# EAGLE design APS_PowerSwitches_USBhub (EAGLE 5.06)
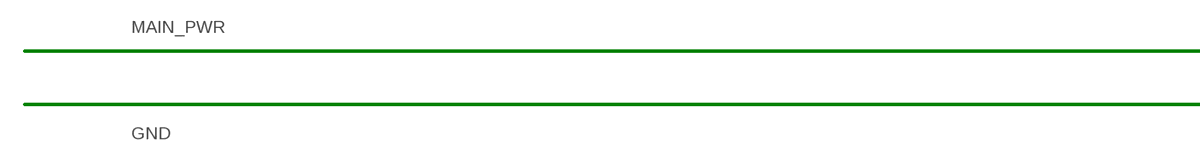
[diagram p0: schematic, sheet 1, part 1 of 3]
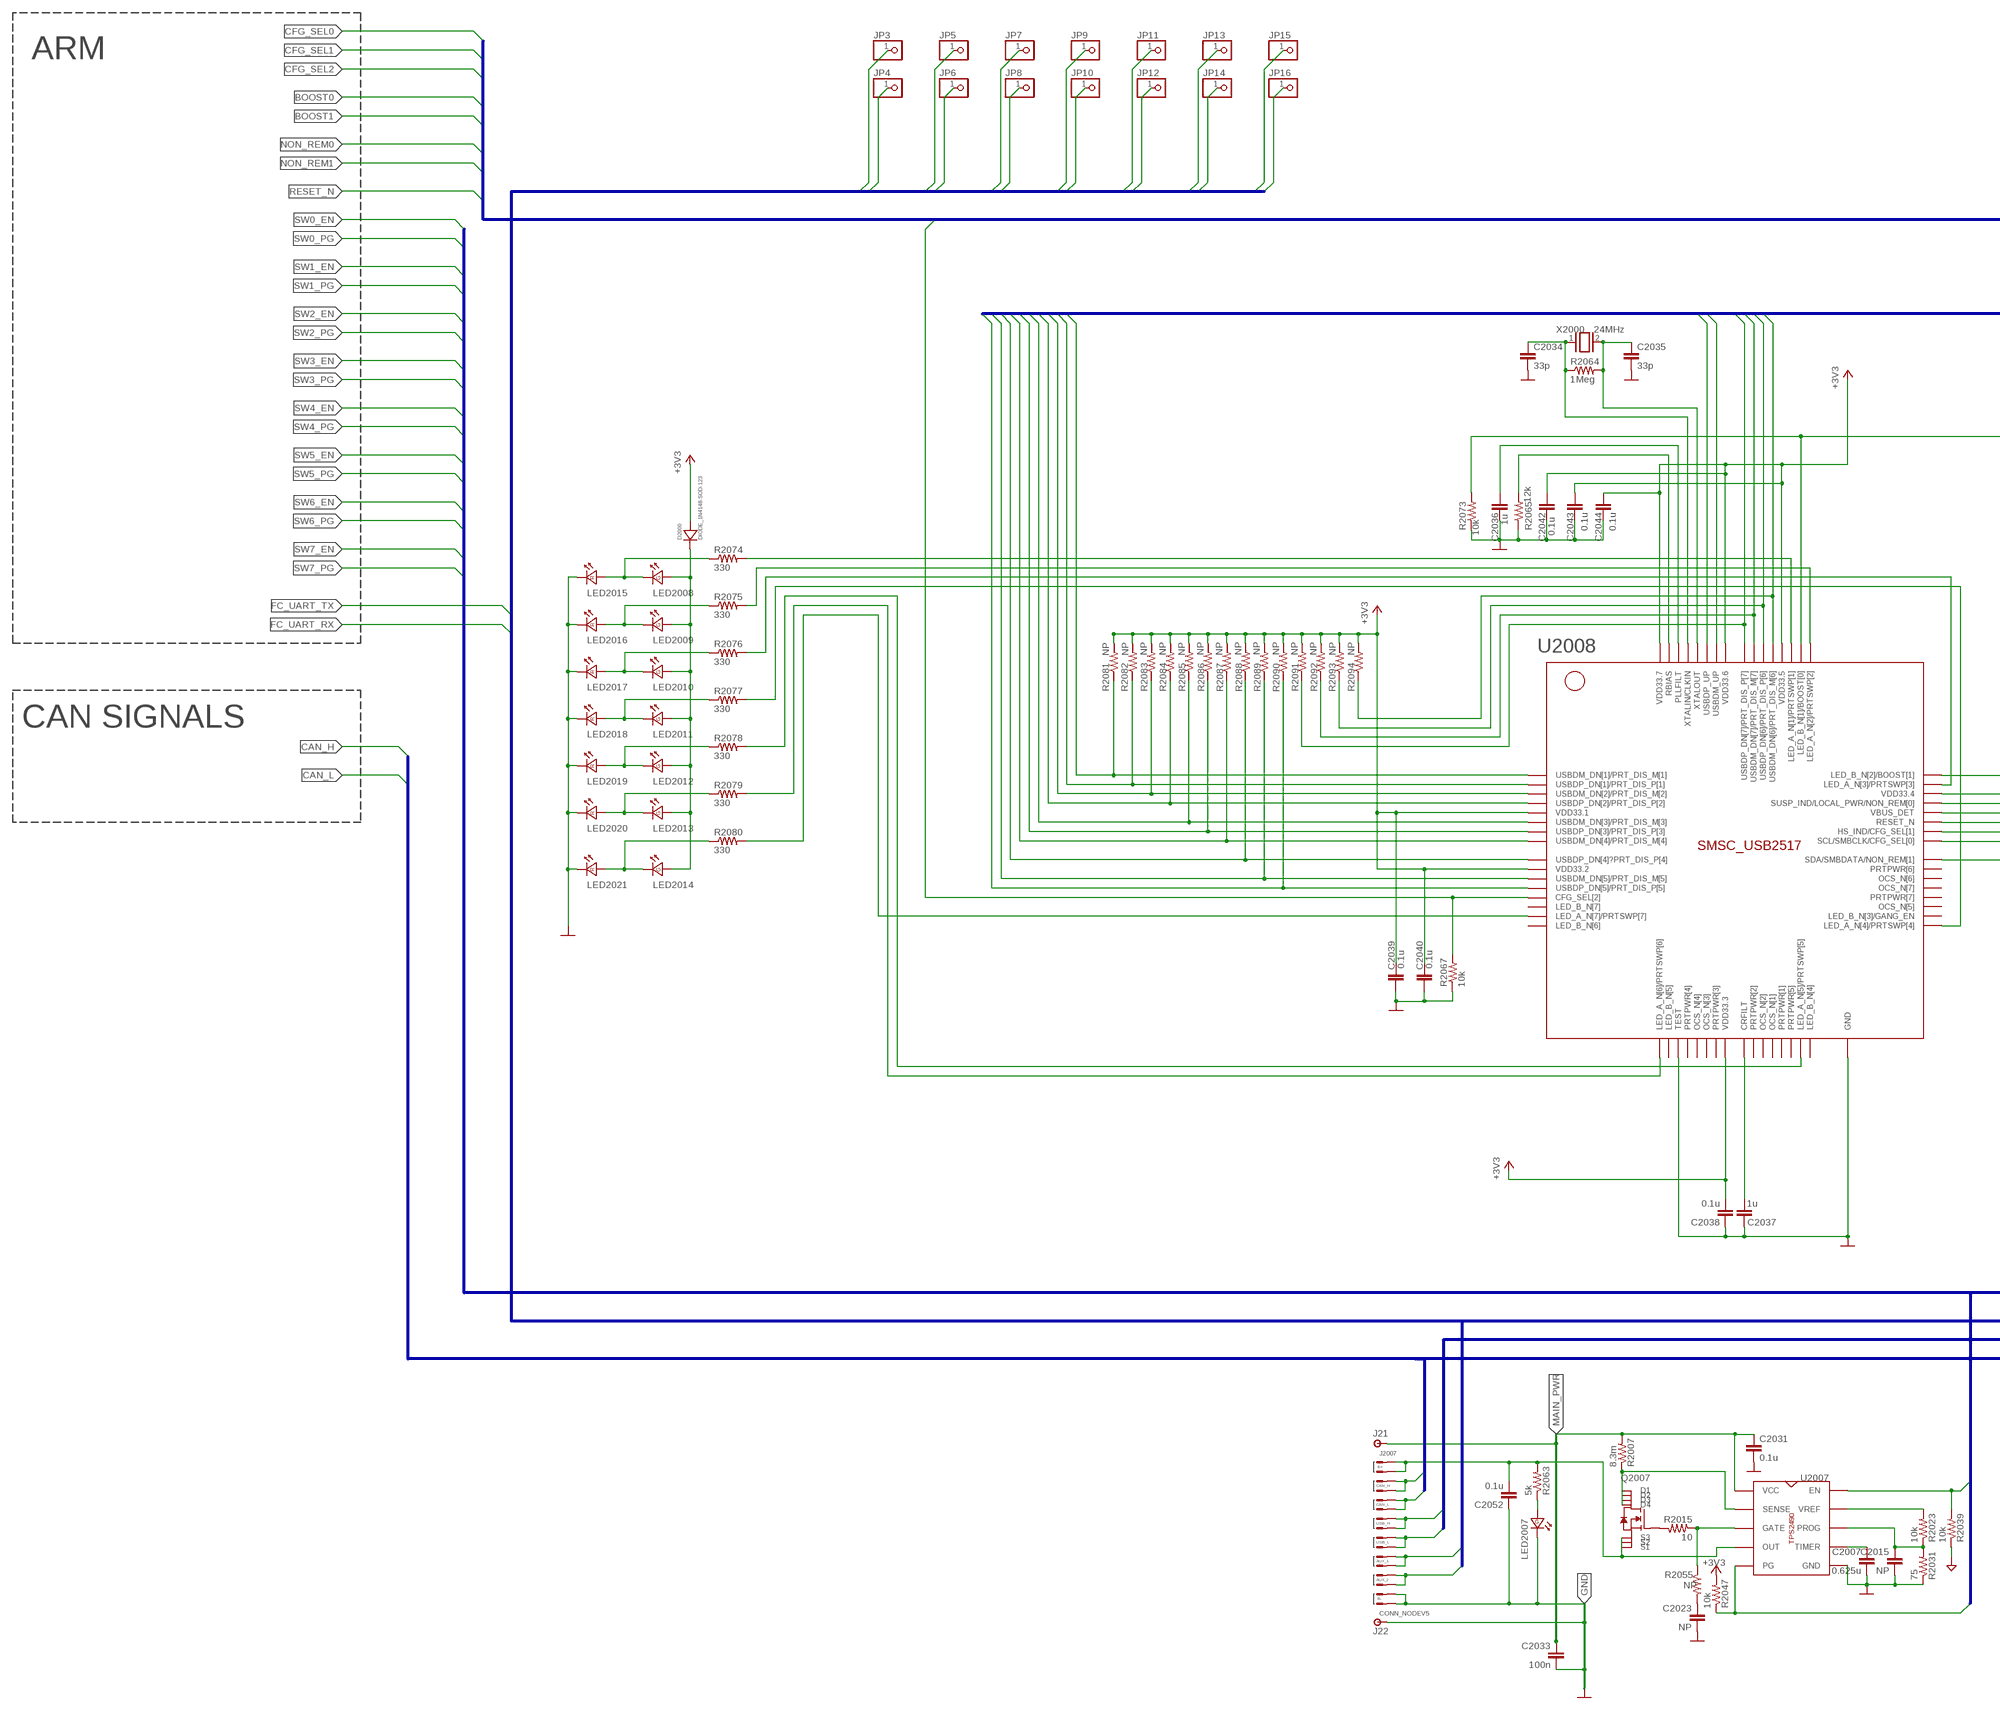
[diagram p1: schematic, sheet 1, part 2 of 3]
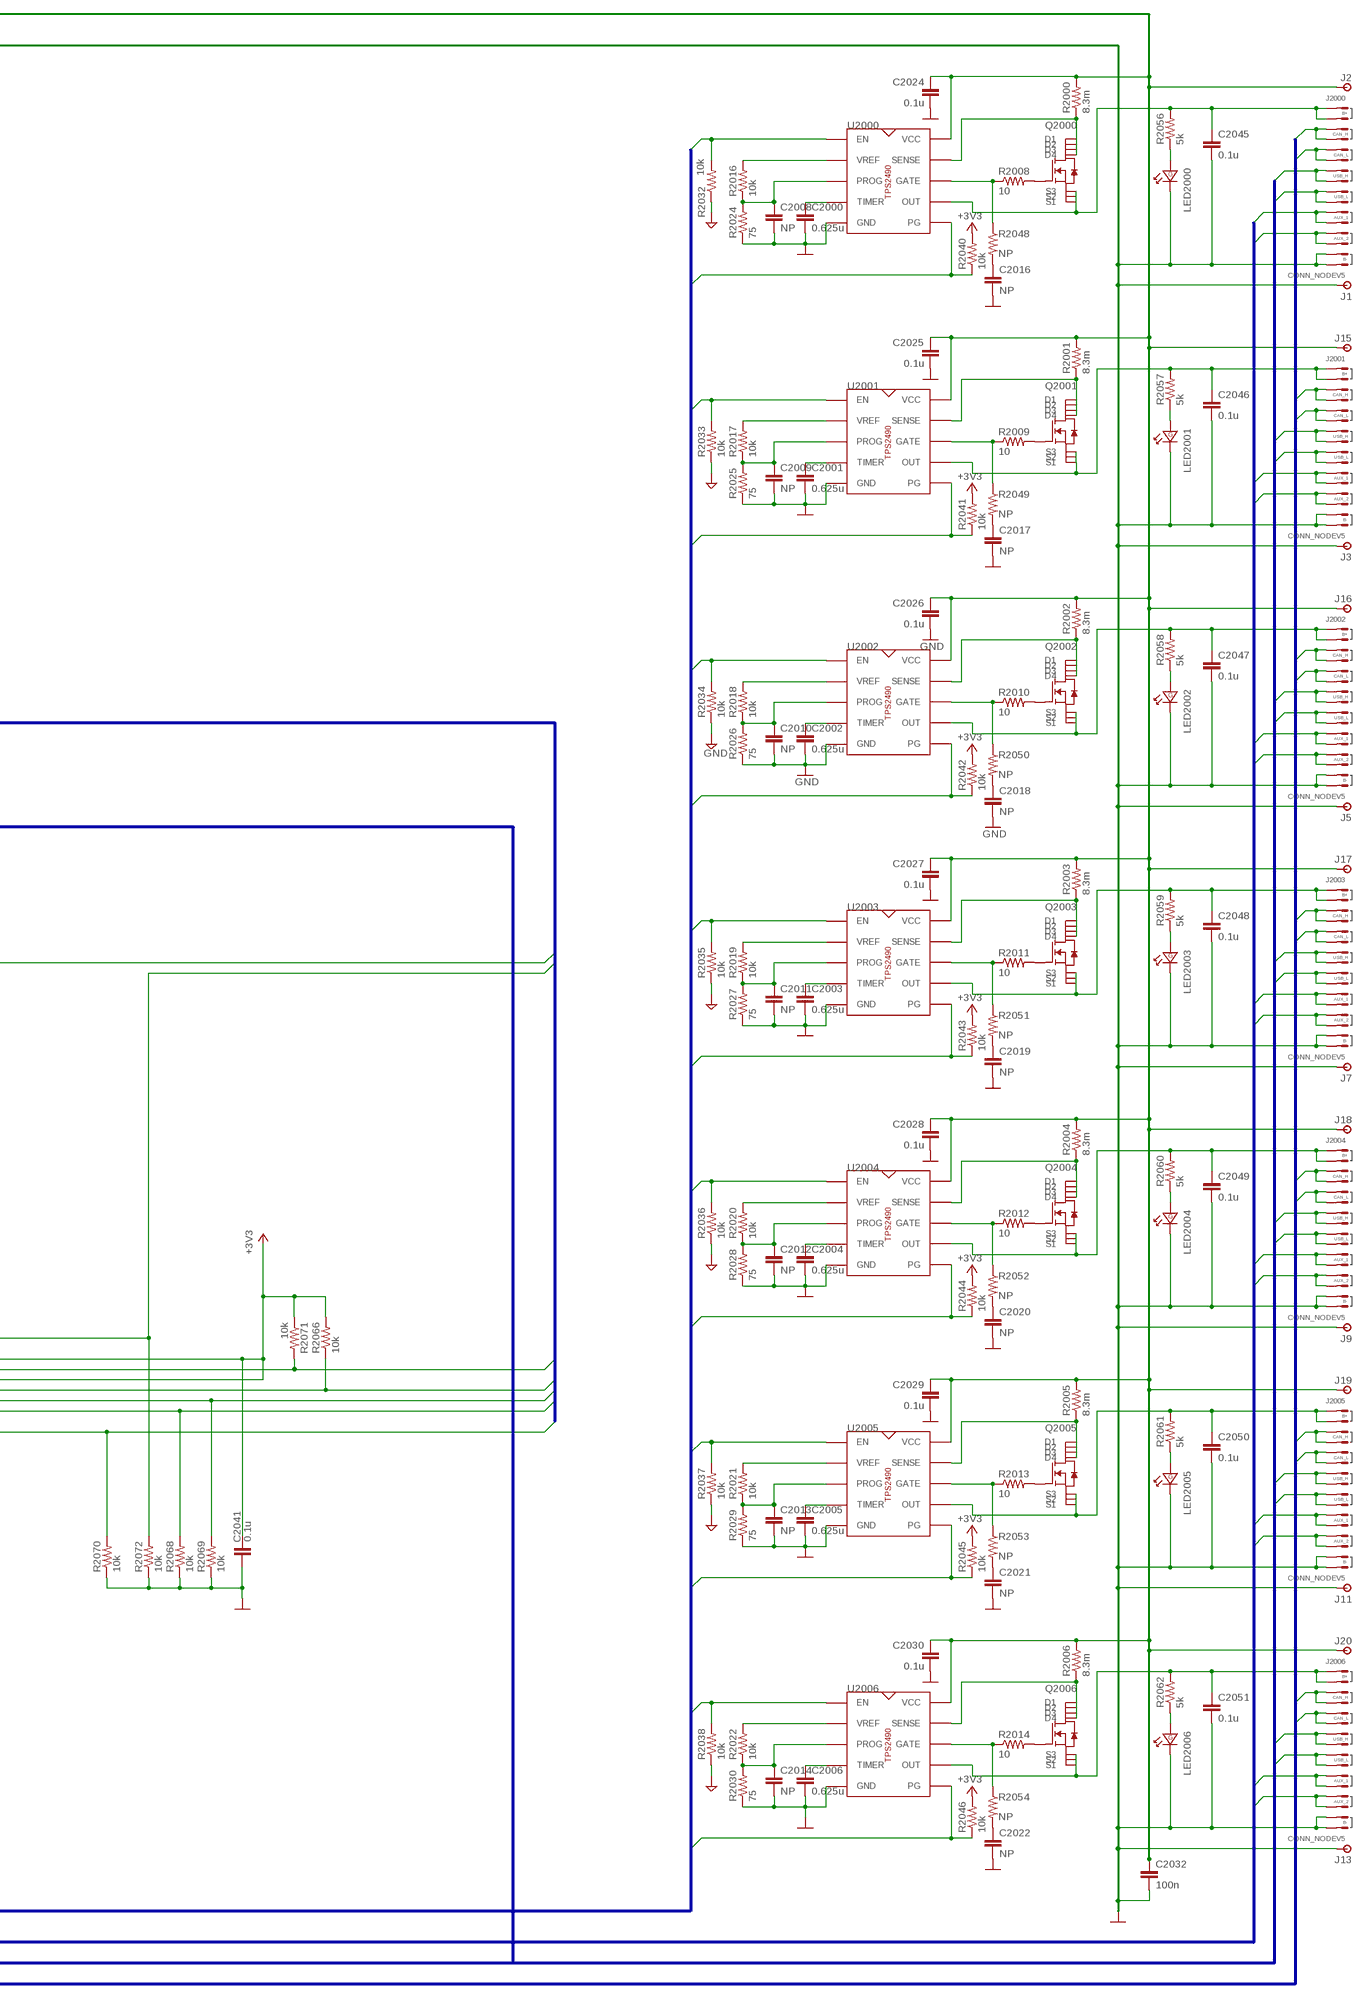
[diagram p2: schematic, sheet 1, part 3 of 3]

## Parts
C2000  0.625u  C-EUC0603  [C0603]
C2001  0.625u  C-EUC0603  [C0603]
C2002  0.625u  C-EUC0603  [C0603]
C2003  0.625u  C-EUC0603  [C0603]
C2004  0.625u  C-EUC0603  [C0603]
C2005  0.625u  C-EUC0603  [C0603]
C2006  0.625u  C-EUC0603  [C0603]
C2007  0.625u  C-EUC0603  [C0603]
C2008  NP  C-EUC0603  [C0603]
C2009  NP  C-EUC0603  [C0603]
C2010  NP  C-EUC0603  [C0603]
C2011  NP  C-EUC0603  [C0603]
C2012  NP  C-EUC0603  [C0603]
C2013  NP  C-EUC0603  [C0603]
C2014  NP  C-EUC0603  [C0603]
C2015  NP  C-EUC0603  [C0603]
C2016  NP  C-EUC0603  [C0603]
C2017  NP  C-EUC0603  [C0603]
C2018  NP  C-EUC0603  [C0603]
C2019  NP  C-EUC0603  [C0603]
C2020  NP  C-EUC0603  [C0603]
C2021  NP  C-EUC0603  [C0603]
C2022  NP  C-EUC0603  [C0603]
C2023  NP  C-EUC0603  [C0603]
C2024  0.1u  C-EUC0603  [C0603]
C2025  0.1u  C-EUC0603  [C0603]
C2026  0.1u  C-EUC0603  [C0603]
C2027  0.1u  C-EUC0603  [C0603]
C2028  0.1u  C-EUC0603  [C0603]
C2029  0.1u  C-EUC0603  [C0603]
C2030  0.1u  C-EUC0603  [C0603]
C2031  0.1u  C-EUC0603  [C0603]
C2032  100n  C-EUC0805  [C0805]
C2033  100n  C-EUC0805  [C0805]
C2034  33p  C-EUC0603  [C0603]
C2035  33p  C-EUC0603  [C0603]
C2036  1u  C-EUC0603  [C0603]
C2037  1u  C-EUC0603  [C0603]
C2038  0.1u  C-EUC0603  [C0603]
C2039  0.1u  C-EUC0603  [C0603]
C2040  0.1u  C-EUC0603  [C0603]
C2041  0.1u  C-EUC0603  [C0603]
C2042  0.1u  C-EUC0603  [C0603]
C2043  0.1u  C-EUC0603  [C0603]
C2044  0.1u  C-EUC0603  [C0603]
C2045  0.1u  C-EUC0603  [C0603]
C2046  0.1u  C-EUC0603  [C0603]
C2047  0.1u  C-EUC0603  [C0603]
C2048  0.1u  C-EUC0603  [C0603]
C2049  0.1u  C-EUC0603  [C0603]
C2050  0.1u  C-EUC0603  [C0603]
C2051  0.1u  C-EUC0603  [C0603]
C2052  0.1u  C-EUC0603  [C0603]
D2000  DIODE_1N4148-SOD-123  [SOD-123-DIODE]
J1  PAD_ROUND028  [PAD_ROUND_APC-FREE_0.1/028]
J2  PAD_ROUND028  [PAD_ROUND_APC-FREE_0.1/028]
J3  PAD_ROUND028  [PAD_ROUND_APC-FREE_0.1/028]
J5  PAD_ROUND028  [PAD_ROUND_APC-FREE_0.1/028]
J7  PAD_ROUND028  [PAD_ROUND_APC-FREE_0.1/028]
J9  PAD_ROUND028  [PAD_ROUND_APC-FREE_0.1/028]
J11  PAD_ROUND028  [PAD_ROUND_APC-FREE_0.1/028]
J13  PAD_ROUND028  [PAD_ROUND_APC-FREE_0.1/028]
J15  PAD_ROUND028  [PAD_ROUND_APC-FREE_0.1/028]
J16  PAD_ROUND028  [PAD_ROUND_APC-FREE_0.1/028]
J17  PAD_ROUND028  [PAD_ROUND_APC-FREE_0.1/028]
J18  PAD_ROUND028  [PAD_ROUND_APC-FREE_0.1/028]
J19  PAD_ROUND028  [PAD_ROUND_APC-FREE_0.1/028]
J20  PAD_ROUND028  [PAD_ROUND_APC-FREE_0.1/028]
J21  PAD_ROUND028  [PAD_ROUND_APC-FREE_0.1/028]
J22  PAD_ROUND028  [PAD_ROUND_APC-FREE_0.1/028]
J2000  CONN_NODEV5  [CONN_16PIN_NODEV5]
J2001  CONN_NODEV5  [CONN_16PIN_NODEV5]
J2002  CONN_NODEV5  [CONN_16PIN_NODEV5]
J2003  CONN_NODEV5  [CONN_16PIN_NODEV5]
J2004  CONN_NODEV5  [CONN_16PIN_NODEV5]
J2005  CONN_NODEV5  [CONN_16PIN_NODEV5]
J2006  CONN_NODEV5  [CONN_16PIN_NODEV5]
J2007  CONN_NODEV5  [CONN_16PIN_NODEV5]
JP3  PINHD-1X1  [1X01]
JP4  PINHD-1X1  [1X01]
JP5  PINHD-1X1  [1X01]
JP6  PINHD-1X1  [1X01]
JP7  PINHD-1X1  [1X01]
JP8  PINHD-1X1  [1X01]
JP9  PINHD-1X1  [1X01]
JP10  PINHD-1X1  [1X01]
JP11  PINHD-1X1  [1X01]
JP12  PINHD-1X1  [1X01]
JP13  PINHD-1X1  [1X01]
JP14  PINHD-1X1  [1X01]
JP15  PINHD-1X1  [1X01]
JP16  PINHD-1X1  [1X01]
LED2000  LED-GRN-  [0603-DIODE]
LED2001  LED-GRN-  [0603-DIODE]
LED2002  LED-GRN-  [0603-DIODE]
LED2003  LED-GRN-  [0603-DIODE]
LED2004  LED-GRN-  [0603-DIODE]
LED2005  LED-GRN-  [0603-DIODE]
LED2006  LED-GRN-  [0603-DIODE]
LED2007  LED-GRN-  [0603-DIODE]
LED2008  LED-GRN-  [0603-DIODE]
LED2009  LED-GRN-  [0603-DIODE]
LED2010  LED-GRN-  [0603-DIODE]
LED2011  LED-GRN-  [0603-DIODE]
LED2012  LED-GRN-  [0603-DIODE]
LED2013  LED-GRN-  [0603-DIODE]
LED2014  LED-GRN-  [0603-DIODE]
LED2015  LED-RED-0603  [0603-DIODE]
LED2016  LED-RED-0603  [0603-DIODE]
LED2017  LED-RED-0603  [0603-DIODE]
LED2018  LED-RED-0603  [0603-DIODE]
LED2019  LED-RED-0603  [0603-DIODE]
LED2020  LED-RED-0603  [0603-DIODE]
LED2021  LED-RED-0603  [0603-DIODE]
Q2000  SI4122DY  [SO-8]
Q2001  SI4122DY  [SO-8]
Q2002  SI4122DY  [SO-8]
Q2003  SI4122DY  [SO-8]
Q2004  SI4122DY  [SO-8]
Q2005  SI4122DY  [SO-8]
Q2006  SI4122DY  [SO-8]
Q2007  SI4122DY  [SO-8]
R2000  8.3m  R-US_R0603  [R0603]
R2001  8.3m  R-US_R0603  [R0603]
R2002  8.3m  R-US_R0603  [R0603]
R2003  8.3m  R-US_R0603  [R0603]
R2004  8.3m  R-US_R0603  [R0603]
R2005  8.3m  R-US_R0603  [R0603]
R2006  8.3m  R-US_R0603  [R0603]
R2007  8.3m  R-US_R0603  [R0603]
R2008  10  R-US_R0603  [R0603]
R2009  10  R-US_R0603  [R0603]
R2010  10  R-US_R0603  [R0603]
R2011  10  R-US_R0603  [R0603]
R2012  10  R-US_R0603  [R0603]
R2013  10  R-US_R0603  [R0603]
R2014  10  R-US_R0603  [R0603]
R2015  10  R-US_R0603  [R0603]
R2016  10k  R-US_R0603  [R0603]
R2017  10k  R-US_R0603  [R0603]
R2018  10k  R-US_R0603  [R0603]
R2019  10k  R-US_R0603  [R0603]
R2020  10k  R-US_R0603  [R0603]
R2021  10k  R-US_R0603  [R0603]
R2022  10k  R-US_R0603  [R0603]
R2023  10k  R-US_R0603  [R0603]
R2024  75  R-US_R0603  [R0603]
R2025  75  R-US_R0603  [R0603]
R2026  75  R-US_R0603  [R0603]
R2027  75  R-US_R0603  [R0603]
R2028  75  R-US_R0603  [R0603]
R2029  75  R-US_R0603  [R0603]
R2030  75  R-US_R0603  [R0603]
R2031  75  R-US_R0603  [R0603]
R2032  10k  R-US_R0603  [R0603]
R2033  10k  R-US_R0603  [R0603]
R2034  10k  R-US_R0603  [R0603]
R2035  10k  R-US_R0603  [R0603]
R2036  10k  R-US_R0603  [R0603]
R2037  10k  R-US_R0603  [R0603]
R2038  10k  R-US_R0603  [R0603]
R2039  10k  R-US_R0603  [R0603]
R2040  10k  R-US_R0603  [R0603]
R2041  10k  R-US_R0603  [R0603]
R2042  10k  R-US_R0603  [R0603]
R2043  10k  R-US_R0603  [R0603]
R2044  10k  R-US_R0603  [R0603]
R2045  10k  R-US_R0603  [R0603]
R2046  10k  R-US_R0603  [R0603]
R2047  10k  R-US_R0603  [R0603]
R2048  NP  R-US_R0603  [R0603]
R2049  NP  R-US_R0603  [R0603]
R2050  NP  R-US_R0603  [R0603]
R2051  NP  R-US_R0603  [R0603]
R2052  NP  R-US_R0603  [R0603]
R2053  NP  R-US_R0603  [R0603]
R2054  NP  R-US_R0603  [R0603]
R2055  NP  R-US_R0603  [R0603]
R2056  5k  R-US_R0603  [R0603]
R2057  5k  R-US_R0603  [R0603]
R2058  5k  R-US_R0603  [R0603]
R2059  5k  R-US_R0603  [R0603]
R2060  5k  R-US_R0603  [R0603]
R2061  5k  R-US_R0603  [R0603]
R2062  5k  R-US_R0603  [R0603]
R2063  5k  R-US_R0603  [R0603]
R2064  1Meg  R-US_R0603  [R0603]
R2065  12k  R-US_R0603  [R0603]
R2066  10k  R-US_R0603  [R0603]
R2067  10k  R-US_R0603  [R0603]
R2068  10k  R-US_R0603  [R0603]
R2069  10k  R-US_R0603  [R0603]
R2070  10k  R-US_R0603  [R0603]
R2071  10k  R-US_R0603  [R0603]
R2072  10k  R-US_R0603  [R0603]
R2073  10k  R-US_R0603  [R0603]
R2074  330  R-US_R0603  [R0603]
R2075  330  R-US_R0603  [R0603]
R2076  330  R-US_R0603  [R0603]
R2077  330  R-US_R0603  [R0603]
R2078  330  R-US_R0603  [R0603]
R2079  330  R-US_R0603  [R0603]
R2080  330  R-US_R0603  [R0603]
R2081  NP  R-US_R0603  [R0603]
R2082  NP  R-US_R0603  [R0603]
R2083  NP  R-US_R0603  [R0603]
R2084  NP  R-US_R0603  [R0603]
R2085  NP  R-US_R0603  [R0603]
R2086  NP  R-US_R0603  [R0603]
R2087  NP  R-US_R0603  [R0603]
R2088  NP  R-US_R0603  [R0603]
R2089  NP  R-US_R0603  [R0603]
R2090  NP  R-US_R0603  [R0603]
R2091  NP  R-US_R0603  [R0603]
R2092  NP  R-US_R0603  [R0603]
R2093  NP  R-US_R0603  [R0603]
R2094  NP  R-US_R0603  [R0603]
U2000  TPS2490  [DGS]
U2001  TPS2490  [DGS]
U2002  TPS2490  [DGS]
U2003  TPS2490  [DGS]
U2004  TPS2490  [DGS]
U2005  TPS2490  [DGS]
U2006  TPS2490  [DGS]
U2007  TPS2490  [DGS]
U2008  IC_SMSC_USB2517  [QFN-64]
X2000  24MHz  XTAL  [Q]

## Nets
+3V3: C2038.2 C2039.2 C2040.2 C2041.2 C2042.2 C2043.2 C2044.2 D2000.2(ANODE)(ANODE) R2040.2 R2041.2 R2042.2 R2043.2 R2044.2 R2045.2 R2046.2 R2047.2 R2066.2 R2071.1 R2081.2 R2082.2 R2083.2 R2084.2 R2085.2 R2086.2 R2087.2 R2088.2 R2089.2 R2090.2 R2091.2 R2092.2 R2093.2 R2094.2 U2008.VBUS_DET U2008.VDD33.1 U2008.VDD33.2 U2008.VDD33.3 U2008.VDD33.4 U2008.VDD33.5 U2008.VDD33.6 U2008.VDD33.7
AUX_1.1: J2000.BOARD+@1(BOARD+1) J2000.BOARD+@2(BOARD+2) JP16.1
AUX_1.2: J2001.BOARD+@1(BOARD+1) J2001.BOARD+@2(BOARD+2) JP14.1
AUX_1.3: J2002.BOARD+@1(BOARD+1) J2002.BOARD+@2(BOARD+2) JP12.1
AUX_1.4: J2003.BOARD+@1(BOARD+1) J2003.BOARD+@2(BOARD+2) JP10.1
AUX_1.5: J2004.BOARD+@1(BOARD+1) J2004.BOARD+@2(BOARD+2) JP8.1
AUX_1.6: J2005.BOARD+@1(BOARD+1) J2005.BOARD+@2(BOARD+2) JP6.1
AUX_1.7: J2006.BOARD+@1(BOARD+1) J2006.BOARD+@2(BOARD+2) JP4.1
AUX_2.1: J2000.BOARD-@1(BOARD-1) J2000.BOARD-@2(BOARD-2) JP15.1
AUX_2.2: J2001.BOARD-@1(BOARD-1) J2001.BOARD-@2(BOARD-2) JP13.1
AUX_2.3: J2002.BOARD-@1(BOARD-1) J2002.BOARD-@2(BOARD-2) JP11.1
AUX_2.4: J2003.BOARD-@1(BOARD-1) J2003.BOARD-@2(BOARD-2) JP9.1
AUX_2.5: J2004.BOARD-@1(BOARD-1) J2004.BOARD-@2(BOARD-2) JP7.1
AUX_2.6: J2005.BOARD-@1(BOARD-1) J2005.BOARD-@2(BOARD-2) JP5.1
AUX_2.7: J2006.BOARD-@1(BOARD-1) J2006.BOARD-@2(BOARD-2) JP3.1
BOOST0: R2073.2 U2008.LED_B_N[1]/BOOST[0]
BOOST1: R2072.2 U2008.LED_B_N[2]/BOOST[1]
CAN_H: J2000.CAN+@1(CAN_H1) J2000.CAN+@2(CAN_H2) J2001.CAN+@1(CAN_H1) J2001.CAN+@2(CAN_H2) J2002.CAN+@1(CAN_H1) J2002.CAN+@2(CAN_H2) J2003.CAN+@1(CAN_H1) J2003.CAN+@2(CAN_H2) J2004.CAN+@1(CAN_H1) J2004.CAN+@2(CAN_H2) J2005.CAN+@1(CAN_H1) J2005.CAN+@2(CAN_H2) J2006.CAN+@1(CAN_H1) J2006.CAN+@2(CAN_H2) J2007.CAN+@1(CAN_H1) J2007.CAN+@2(CAN_H2)
CAN_L: J2000.CAN-@1(CAN_L1) J2000.CAN-@2(CAN_L2) J2001.CAN-@1(CAN_L1) J2001.CAN-@2(CAN_L2) J2002.CAN-@1(CAN_L1) J2002.CAN-@2(CAN_L2) J2003.CAN-@1(CAN_L1) J2003.CAN-@2(CAN_L2) J2004.CAN-@1(CAN_L1) J2004.CAN-@2(CAN_L2) J2005.CAN-@1(CAN_L1) J2005.CAN-@2(CAN_L2) J2006.CAN-@1(CAN_L1) J2006.CAN-@2(CAN_L2) J2007.CAN-@1(CAN_L1) J2007.CAN-@2(CAN_L2)
CFG_SEL0: R2068.2 U2008.SCL/SMBCLK/CFG_SEL[0]
CFG_SEL1: R2069.2 U2008.HS_IND/CFG_SEL[1]
CFG_SEL2: R2067.2 U2008.CFG_SEL[2]
CRFILT: C2037.2 U2008.CRFILT
FC_UART_RX: J2007.BOARD-@1(BOARD-1) J2007.BOARD-@2(BOARD-2)
FC_UART_TX: J2007.BOARD+@1(BOARD+1) J2007.BOARD+@2(BOARD+2)
GND: C2000.2 C2001.2 C2002.2 C2003.2 C2004.2 C2005.2 C2006.2 C2007.2 C2008.2 C2009.2 C2010.2 C2011.2 C2012.2 C2013.2 C2014.2 C2015.2 C2016.2 C2017.2 C2018.2 C2019.2 C2020.2 C2021.2 C2022.2 C2023.2 C2024.2 C2025.2 C2026.2 C2027.2 C2028.2 C2029.2 C2030.2 C2031.2 C2032.2 C2033.2 C2034.2 C2035.2 C2036.1 C2037.1 C2038.1 C2039.1 C2040.1 C2041.1 C2042.1 C2043.1 C2044.1 C2045.2 C2046.2 C2047.2 C2048.2 C2049.2 C2050.2 C2051.2 C2052.1 J1.PAD J3.PAD J5.PAD J7.PAD J9.PAD J11.PAD J13.PAD J22.PAD J2000.B-@1(B-1) J2000.B-@2(B-2) J2001.B-@1(B-1) J2001.B-@2(B-2) J2002.B-@1(B-1) J2002.B-@2(B-2) J2003.B-@1(B-1) J2003.B-@2(B-2) J2004.B-@1(B-1) J2004.B-@2(B-2) J2005.B-@1(B-1) J2005.B-@2(B-2) J2006.B-@1(B-1) J2006.B-@2(B-2) J2007.B-@1(B-1) J2007.B-@2(B-2) LED2000.K(CATHODE) LED2001.K(CATHODE) LED2002.K(CATHODE) LED2003.K(CATHODE) LED2004.K(CATHODE) LED2005.K(CATHODE) LED2006.K(CATHODE) LED2007.K(CATHODE) LED2015.K(CATHODE) LED2016.K(CATHODE) LED2017.K(CATHODE) LED2018.K(CATHODE) LED2019.K(CATHODE) LED2020.K(CATHODE) LED2021.K(CATHODE) R2024.1 R2025.1 R2026.1 R2027.1 R2028.1 R2029.1 R2030.1 R2031.1 R2032.1 R2033.1 R2034.1 R2035.1 R2036.1 R2037.1 R2038.1 R2039.1 R2065.1 R2067.1 R2068.1 R2069.1 R2070.1 R2072.1 R2073.1 U2000.GND U2001.GND U2002.GND U2003.GND U2004.GND U2005.GND U2006.GND U2007.GND U2008.GND U2008.TEST
LED1: R2074.2 U2008.LED_A_N[1]/PRTSWP[1]
LED2: R2075.2 U2008.LED_A_N[2]/PRTSWP[2]
LED3: R2076.2 U2008.LED_A_N[3]/PRTSWP[3]
LED4: R2077.2 U2008.LED_A_N[4]/PRTSWP[4]
LED5: R2078.2 U2008.LED_A_N[5]/PRTSWP[5]
LED6: R2079.2 U2008.LED_A_N[6]/PRTSWP[6]
LED7: R2080.2 U2008.LED_A_N[7]/PRTSWP[7]
LED_PWR: D2000.1(CATHODE)(CATHODE) LED2008.A(ANODE) LED2009.A(ANODE) LED2010.A(ANODE) LED2011.A(ANODE) LED2012.A(ANODE) LED2013.A(ANODE) LED2014.A(ANODE)
MAIN_PWR: C2024.1 C2025.1 C2026.1 C2027.1 C2028.1 C2029.1 C2030.1 C2031.1 C2032.1 C2033.1 J2.PAD J15.PAD J16.PAD J17.PAD J18.PAD J19.PAD J20.PAD J21.PAD R2000.2 R2001.2 R2002.2 R2003.2 R2004.2 R2005.2 R2006.2 R2007.2 U2000.VCC U2001.VCC U2002.VCC U2003.VCC U2004.VCC U2005.VCC U2006.VCC U2007.VCC
N$2: C2016.1 R2048.2
N$3: C2017.1 R2049.2
N$7: Q2000.G R2008.2
N$8: LED2000.A(ANODE) R2056.1
N$10: LED2001.A(ANODE) R2057.1
N$12: C2019.1 R2051.2
N$17: C2018.1 R2050.2
N$19: LED2002.A(ANODE) R2058.1
N$20: LED2003.A(ANODE) R2059.1
N$23: C2021.1 R2053.2
N$27: C2020.1 R2052.2
N$28: LED2004.A(ANODE) R2060.1
N$29: Q2001.G R2009.2
N$36: C2022.1 R2054.2
N$37: Q2003.G R2011.2
N$38: Q2004.G R2012.2
N$39: Q2006.G R2014.2
N$48: LED2007.A(ANODE) R2063.1
N$50: Q2002.G R2010.2
N$52: LED2006.A(ANODE) R2062.1
N$58: C2023.1 R2055.2
N$59: Q2007.G R2015.2
N$76: LED2009.K(CATHODE) LED2016.A(ANODE) R2075.1
N$81: LED2008.K(CATHODE) LED2015.A(ANODE) R2074.1
N$84: LED2010.K(CATHODE) LED2017.A(ANODE) R2076.1
N$85: LED2011.K(CATHODE) LED2018.A(ANODE) R2077.1
N$86: LED2012.K(CATHODE) LED2019.A(ANODE) R2078.1
N$87: LED2013.K(CATHODE) LED2020.A(ANODE) R2079.1
N$88: LED2014.K(CATHODE) LED2021.A(ANODE) R2080.1
N$104: LED2005.A(ANODE) R2061.1
N$110: Q2005.G R2013.2
NON_REM0: R2071.2 U2008.SUSP_IND/LOCAL_PWR/NON_REM[0]
NON_REM1: R2070.2 U2008.SDA/SMBDATA/NON_REM[1]
PLLFILT: C2036.2 U2008.PLLFILT
RBIAS: R2065.2 U2008.RBIAS
RESET_N: R2066.1 U2008.RESET_N
SW0_EN: R2039.2 U2007.EN
SW0_GATE: R2015.1 R2055.1 U2007.GATE
SW0_OUT: C2052.2 J2007.B+@1(B+1) J2007.B+@2(B+2) Q2007.S1 Q2007.S2 Q2007.S3 R2063.2 U2007.OUT
SW0_PG: R2047.1 U2007.PG
SW0_PROG: C2015.1 R2023.1 R2031.2 U2007.PROG
SW0_SENSE: Q2007.D1 Q2007.D2 Q2007.D3 Q2007.D4 R2007.1 U2007.SENSE
SW0_TIMER: C2007.1 U2007.TIMER
SW0_VREF: R2023.2 U2007.VREF
SW1_EN: R2032.2 U2000.EN
SW1_GATE: R2008.1 R2048.1 U2000.GATE
SW1_OUT: C2045.1 J2000.B+@1(B+1) J2000.B+@2(B+2) Q2000.S1 Q2000.S2 Q2000.S3 R2056.2 U2000.OUT
SW1_PG: R2040.1 U2000.PG
SW1_PROG: C2008.1 R2016.1 R2024.2 U2000.PROG
SW1_SENSE: Q2000.D1 Q2000.D2 Q2000.D3 Q2000.D4 R2000.1 U2000.SENSE
SW1_TIMER: C2000.1 U2000.TIMER
SW1_VREF: R2016.2 U2000.VREF
SW2_EN: R2033.2 U2001.EN
SW2_GATE: R2009.1 R2049.1 U2001.GATE
SW2_OUT: C2046.1 J2001.B+@1(B+1) J2001.B+@2(B+2) Q2001.S1 Q2001.S2 Q2001.S3 R2057.2 U2001.OUT
SW2_PG: R2041.1 U2001.PG
SW2_PROG: C2009.1 R2017.1 R2025.2 U2001.PROG
SW2_SENSE: Q2001.D1 Q2001.D2 Q2001.D3 Q2001.D4 R2001.1 U2001.SENSE
SW2_TIMER: C2001.1 U2001.TIMER
SW2_VREF: R2017.2 U2001.VREF
SW3_EN: R2034.2 U2002.EN
SW3_GATE: R2010.1 R2050.1 U2002.GATE
SW3_OUT: C2047.1 J2002.B+@1(B+1) J2002.B+@2(B+2) Q2002.S1 Q2002.S2 Q2002.S3 R2058.2 U2002.OUT
SW3_PG: R2042.1 U2002.PG
SW3_PROG: C2010.1 R2018.1 R2026.2 U2002.PROG
SW3_SENSE: Q2002.D1 Q2002.D2 Q2002.D3 Q2002.D4 R2002.1 U2002.SENSE
SW3_TIMER: C2002.1 U2002.TIMER
SW3_VREF: R2018.2 U2002.VREF
SW4_EN: R2035.2 U2003.EN
SW4_GATE: R2011.1 R2051.1 U2003.GATE
SW4_OUT: C2048.1 J2003.B+@1(B+1) J2003.B+@2(B+2) Q2003.S1 Q2003.S2 Q2003.S3 R2059.2 U2003.OUT
SW4_PG: R2043.1 U2003.PG
SW4_PROG: C2011.1 R2019.1 R2027.2 U2003.PROG
SW4_SENSE: Q2003.D1 Q2003.D2 Q2003.D3 Q2003.D4 R2003.1 U2003.SENSE
SW4_TIMER: C2003.1 U2003.TIMER
SW4_VREF: R2019.2 U2003.VREF
SW5_EN: R2036.2 U2004.EN
SW5_GATE: R2012.1 R2052.1 U2004.GATE
SW5_OUT: C2049.1 J2004.B+@1(B+1) J2004.B+@2(B+2) Q2004.S1 Q2004.S2 Q2004.S3 R2060.2 U2004.OUT
SW5_PG: R2044.1 U2004.PG
SW5_PROG: C2012.1 R2020.1 R2028.2 U2004.PROG
SW5_SENSE: Q2004.D1 Q2004.D2 Q2004.D3 Q2004.D4 R2004.1 U2004.SENSE
SW5_TIMER: C2004.1 U2004.TIMER
SW5_VREF: R2020.2 U2004.VREF
SW6_EN: R2037.2 U2005.EN
SW6_GATE: R2013.1 R2053.1 U2005.GATE
SW6_OUT: C2050.1 J2005.B+@1(B+1) J2005.B+@2(B+2) Q2005.S1 Q2005.S2 Q2005.S3 R2061.2 U2005.OUT
SW6_PG: R2045.1 U2005.PG
SW6_PROG: C2013.1 R2021.1 R2029.2 U2005.PROG
SW6_SENSE: Q2005.D1 Q2005.D2 Q2005.D3 Q2005.D4 R2005.1 U2005.SENSE
SW6_TIMER: C2005.1 U2005.TIMER
SW6_VREF: R2021.2 U2005.VREF
SW7_EN: R2038.2 U2006.EN
SW7_GATE: R2014.1 R2054.1 U2006.GATE
SW7_OUT: C2051.1 J2006.B+@1(B+1) J2006.B+@2(B+2) Q2006.S1 Q2006.S2 Q2006.S3 R2062.2 U2006.OUT
SW7_PG: R2046.1 U2006.PG
SW7_PROG: C2014.1 R2022.1 R2030.2 U2006.PROG
SW7_SENSE: Q2006.D1 Q2006.D2 Q2006.D3 Q2006.D4 R2006.1 U2006.SENSE
SW7_TIMER: C2006.1 U2006.TIMER
SW7_VREF: R2022.2 U2006.VREF
USB0_H: J2007.USB+@1(USB+1) J2007.USB+@2(USB+2) U2008.USBDP_UP
USB0_L: J2007.USB-@1(USB-1) J2007.USB-@2(USB-2) U2008.USBDM_UP
USB1_H: J2000.USB+@1(USB+1) J2000.USB+@2(USB+2) R2082.1 U2008.USBDP_DN[1]/PRT_DIS_P[1]
USB1_L: J2000.USB-@1(USB-1) J2000.USB-@2(USB-2) R2081.1 U2008.USBDM_DN[1]/PRT_DIS_M[1]
USB2_H: J2001.USB+@1(USB+1) J2001.USB+@2(USB+2) R2084.1 U2008.USBDP_DN[2]/PRT_DIS_P[2]
USB2_L: J2001.USB-@1(USB-1) J2001.USB-@2(USB-2) R2083.1 U2008.USBDM_DN[2]/PRT_DIS_M[2]
USB3_H: J2002.USB+@1(USB+1) J2002.USB+@2(USB+2) R2086.1 U2008.USBDP_DN[3]/PRT_DIS_P[3]
USB3_L: J2002.USB-@1(USB-1) J2002.USB-@2(USB-2) R2085.1 U2008.USBDM_DN[3]/PRT_DIS_M[3]
USB4_H: J2003.USB+@1(USB+1) J2003.USB+@2(USB+2) R2088.1 U2008.USBDP_DN[4]/PRT_DIS_P[4](USBDP_DN[4]?PRT_DIS_P[4])
USB4_L: J2003.USB-@1(USB-1) J2003.USB-@2(USB-2) R2087.1 U2008.USBDM_DN[4]/PRT_DIS_M[4]
USB5_H: J2004.USB+@1(USB+1) J2004.USB+@2(USB+2) R2090.1 U2008.USBDP_DN[5]/PRT_DIS_P[5]
USB5_L: J2004.USB-@1(USB-1) J2004.USB-@2(USB-2) R2089.1 U2008.USBDM_DN[5]/PRT_DIS_M[5]
USB6_H: J2005.USB+@1(USB+1) J2005.USB+@2(USB+2) R2093.1 U2008.USBDP_DN[6]/PRT_DIS_P[6]
USB6_L: J2005.USB-@1(USB-1) J2005.USB-@2(USB-2) R2094.1 U2008.USBDM_DN[6]/PRT_DIS_M[6]
USB7_H: J2006.USB+@1(USB+1) J2006.USB+@2(USB+2) R2091.1 U2008.USBDP_DN[7]/PRT_DIS_P[7]
USB7_L: J2006.USB-@1(USB-1) J2006.USB-@2(USB-2) R2092.1 U2008.USBDM_DN[7]/PRT_DIS_M[7]
XTALIN: C2034.1 R2064.1 U2008.XTALIN/CLKIN X2000.1
XTALOUT: C2035.1 R2064.2 U2008.XTALOUT X2000.2
Unconnected: U2008.LED_B_N[3]/GANG_EN U2008.LED_B_N[4] U2008.LED_B_N[5] U2008.LED_B_N[6] U2008.LED_B_N[7] U2008.OCS_N[1] U2008.OCS_N[2] U2008.OCS_N[3] U2008.OCS_N[4] U2008.OCS_N[5] U2008.OCS_N[6] U2008.OCS_N[7] U2008.PRTPWR[1] U2008.PRTPWR[2] U2008.PRTPWR[3] U2008.PRTPWR[4] U2008.PRTPWR[5] U2008.PRTPWR[6] U2008.PRTPWR[7]

## Buses
CAN_H,CAN_L
USB0_H,USB0_L,USB1_H,USB1_L,USB2_H,USB2_L,USB3_H,USB3_L,USB4_H,USB4_L,USB5_H,USB5_L,USB6_H,USB6_L,USB7_H,USB7_L
FC_UART_TX,FC_UART_RX,AUX_1.1,AUX_2.1,AUX_1.2,AUX_2.2,AUX_1.3,AUX_2.3,AUX_1.4,AUX_2.4,AUX_1.5,AUX_2.5,AUX_1.6,AUX_2.6,AUX_1.7,AUX_2.7
SW0_EN,SW0_PG,SW1_EN,SW1_PG,SW2_EN,SW2_PG,SW3_EN,SW3_PG,SW4_EN,SW4_PG,SW5_EN,SW5_PG,SW6_EN,SW6_PG,SW7_EN,SW7_PG
CFG_SEL0,CFG_SEL1,CFG_SEL2,RESET_N,BOOST0,BOOST1,NON_REM0,NON_REM1

## Notes on the sheet
- ARM
- CAN SIGNALS

## Library data of the parts
C2000-C2052 = rcl:C-EU: CAPACITOR, European symbol
D2000 = psas_eagle_library:DIODE_1N4148?: Generic small signal diode
J1-J3 J5 J7 J9 J11 J13 J15-J22 = psas_eagle_library:PAD_ROUND: Round plated through holes of various sizes, mostly from the apc free drill list.
J2000-J2007 = ScottsLib:CONN_NODEV5: JST-16PS-JED CONNECTOR MODIFIED WITH BOLT HOLES. BOARD+, BOARD- USED IN BOARD-BOARD CONNECTIONS
JP3-JP16 = pinhead:PINHD-1X1: PIN HEADER
LED2000-LED2014 = psas_eagle_library:LED-GRN-?
LED2015-LED2021 = psas_eagle_library:LED-RED-?: Red LED
Q2000-Q2007 = ScottsLib:SI4122DY
R2000-R2094 = rcl:R-US_: RESISTOR, American symbol
U2000-U2007 = ScottsLib:TPS2490
U2008 = ScottsLib:IC_SMSC_USB2517
X2000 = special:XTAL: CRYSTAL

## Board
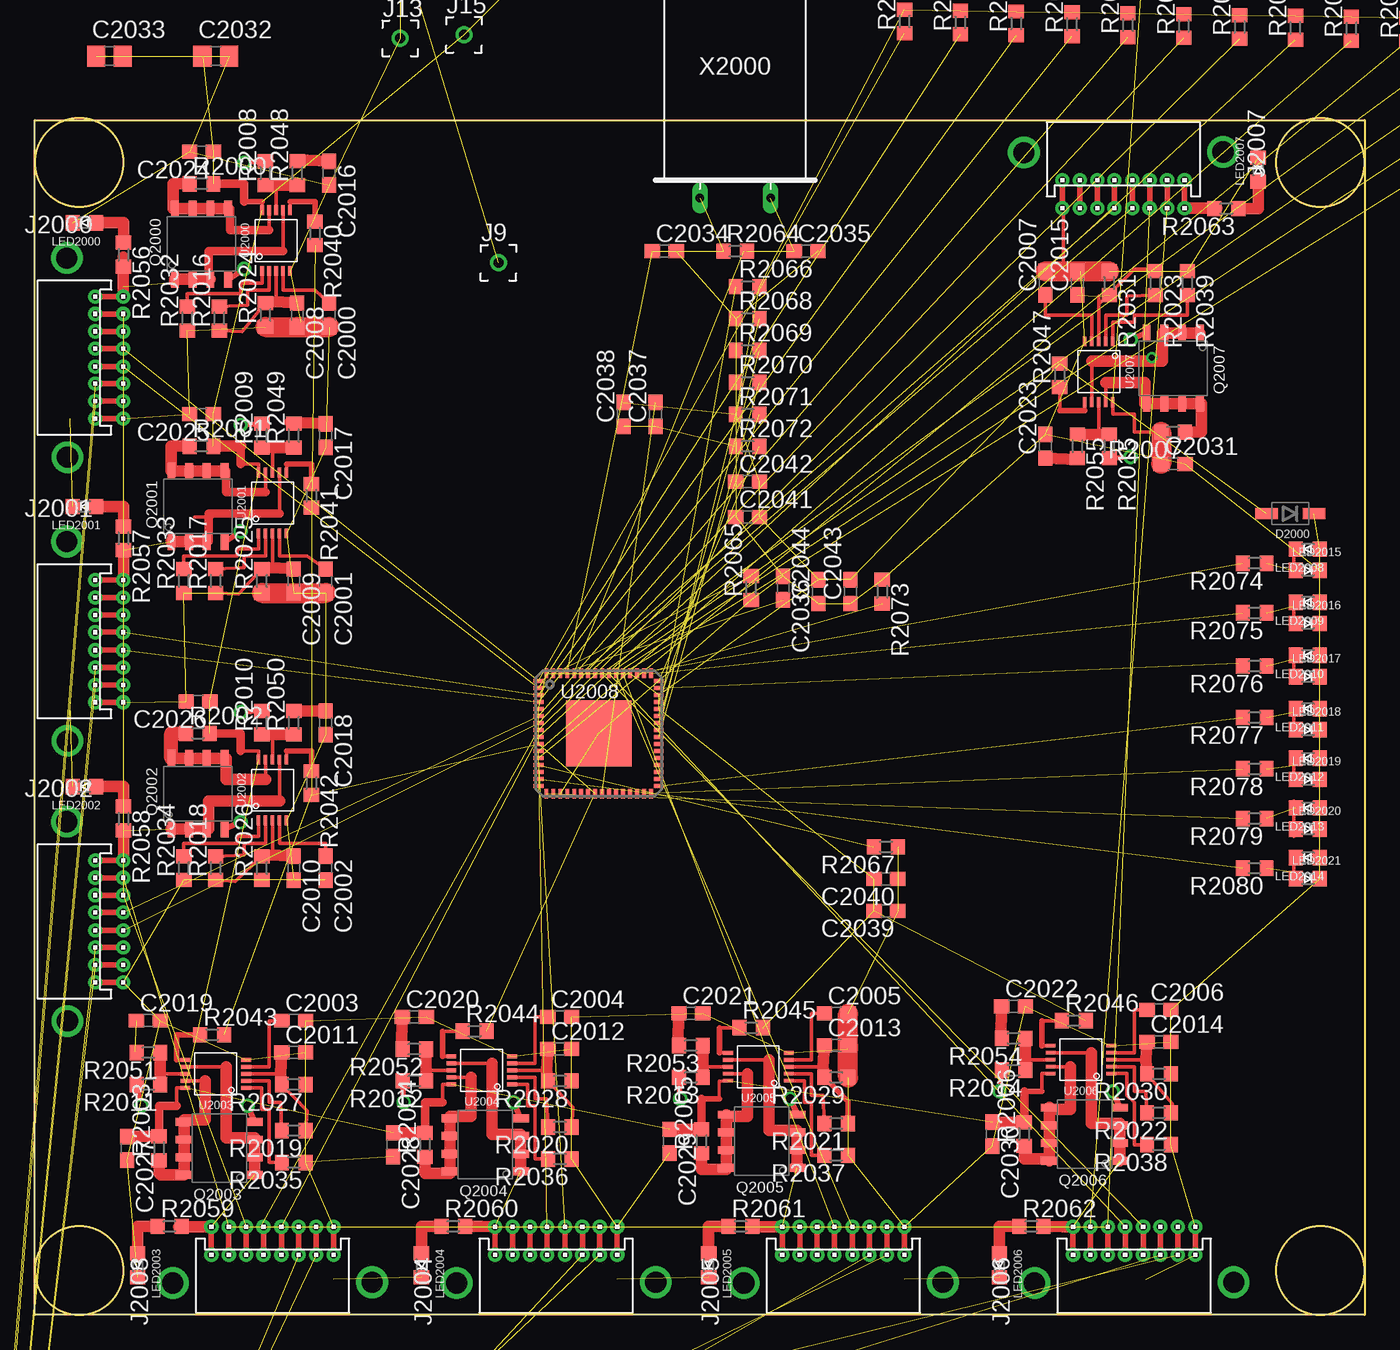
[diagram p3: board, top side]
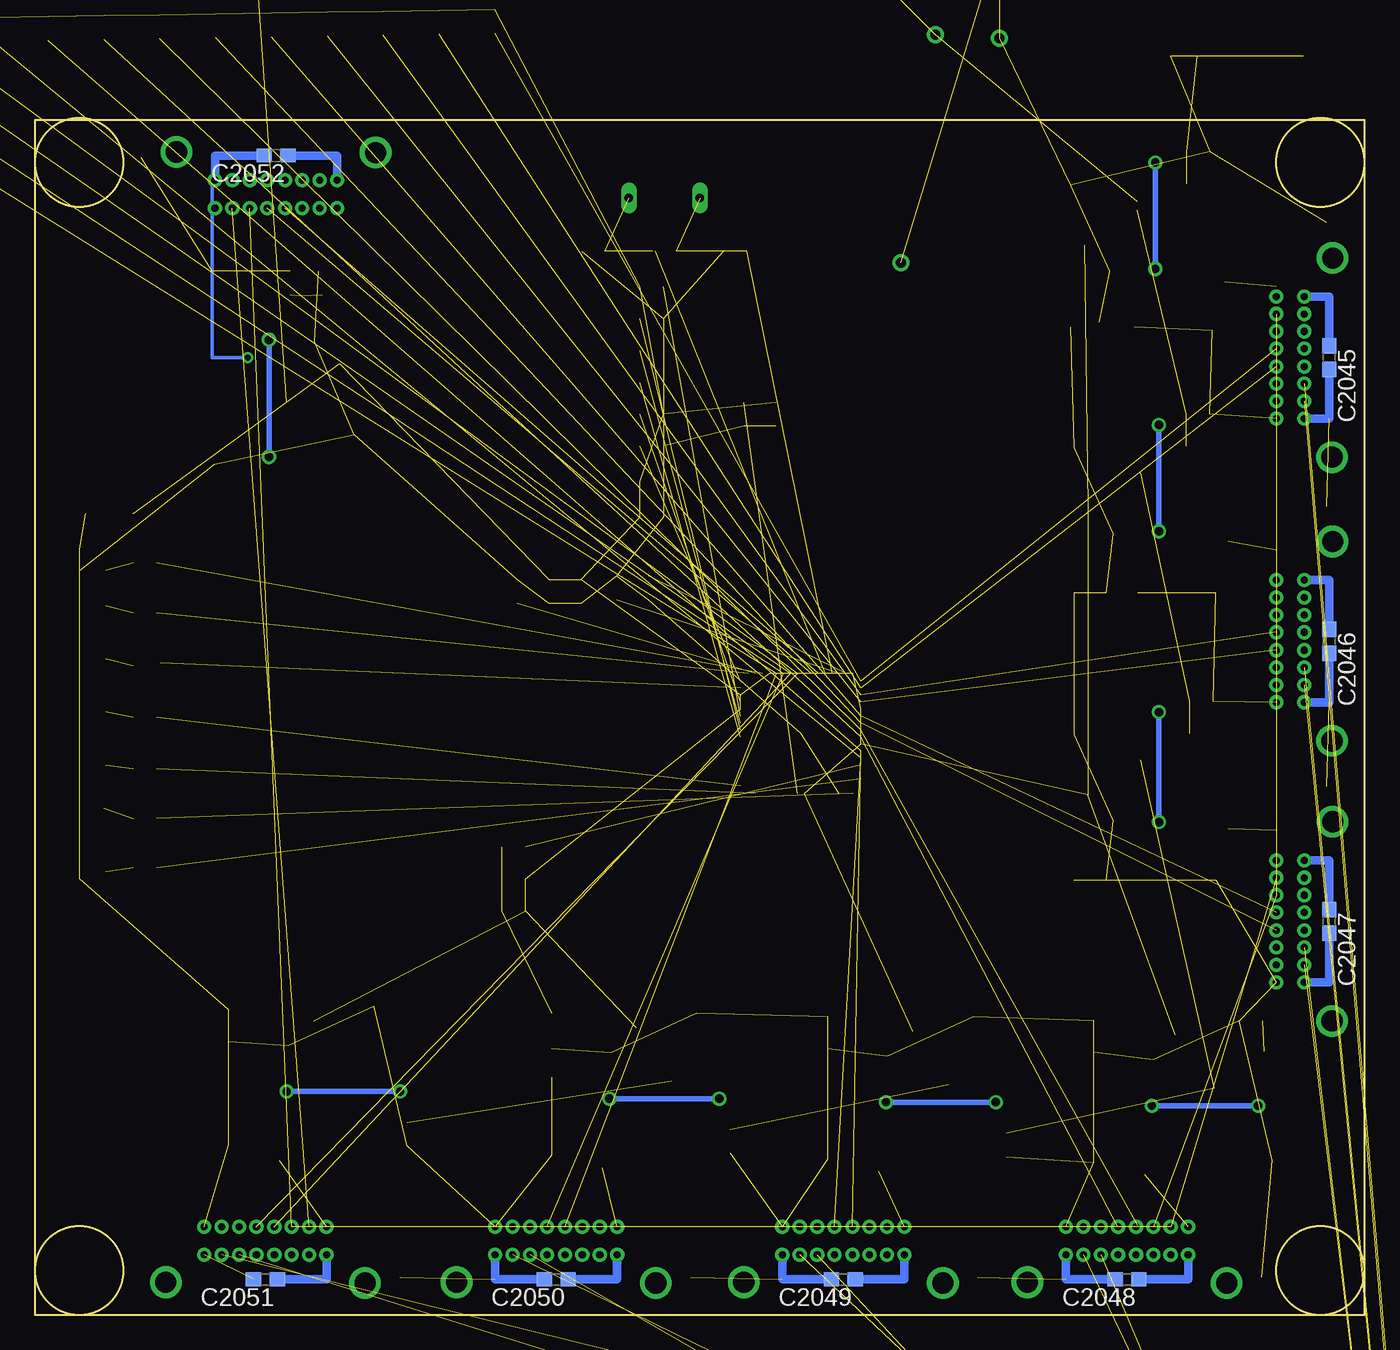
[diagram p4: board, bottom side, seen from below]

Size 95.25 x 85.72 mm. Coordinates in mm from the lower left corner, seen from the top.
Outline: 0,0 0,85.6 95.25,85.6 95.25,0 0,0
Outline: circle at 3.17,82.55 radius 3.17
Outline: circle at 92.08,82.55 radius 3.17
Outline: circle at 3.17,3.17 radius 3.17
Outline: circle at 92.08,3.17 radius 3.17
Copper layers (1*16): Top 0.035mm / dielectric 1.5mm / Bottom 0.035mm
Design rules "default *": minimum track width 10mil, minimum drill 16mil, track to track 8mil, track to pad 8mil, pad to pad 8mil, via to via 8mil, smd to smd 8mil, copper to edge 40mil, drill to drill 8mil, minimum pad ring 10mil, minimum via ring 8mil, stop-mask expansion 4mil, vias tented up to drill 0mil, thermal gap 10mil

### Footprints (pad centres in the part's own frame; a part is rotated, then mirrored left to right if it is on the bottom)
C0603 = smd 1.1 x 1: 1 -0.85,0; 2 0.85,0
C0805 = smd 1.3 x 1.5: 1 -0.95,0; 2 0.95,0
SOD-123-DIODE = smd 1.6 x 0.8: 1(CATHODE) -1.7,0; 2(ANODE) 1.7,0
PAD_ROUND_APC-FREE_0.1/028 = drill 0.711 round: PAD 0,0
CONN_16PIN_NODEV5 = drill 0.508 pad 1.016 round: B+@1 0,4.375; B+@2 2,4.375; B-@1 0,-4.375; B-@2 2,-4.375; BOARD+@1 0,-1.875; BOARD+@2 2,-1.875; BOARD-@1 0,-3.125; BOARD-@2 2,-3.125; CAN+@1 0,3.125; CAN+@2 2,3.125; CAN-@1 0,1.875; CAN-@2 2,1.875; USB+@1 0,-0.645; USB+@2 2,-0.645; USB-@1 0,0.645; USB-@2 2,0.645 | drill 1.511 round: CHASSIS@1 -2.032,7.136; CHASSIS@2 -1.982,-7.136
1X01 = drill 1.016 octagon: 1 0,0
0603-DIODE = smd 1 x 1.1: A -0.85,0; K 0.85,0
SO-8 = smd 1.194 x 0.559: D1 2.527,-1.9; D2 2.527,-0.63; D3 2.527,0.64; D4 2.527,1.91; G -2.527,-1.9; S1 -2.527,1.91; S2 -2.527,0.64; S3 -2.527,-0.63; S4 -2.527,0.64
R0603 = smd 1 x 1.1: 1 -0.85,0; 2 0.85,0
DGS = smd 0.7 x 0.27: EN -2.175,1; GATE 2.175,0; GND -2.175,-1; OUT 2.175,-0.5; PG 2.175,-1; PROG -2.175,0; SENSE 2.175,0.5; TIMER -2.175,-0.5; VCC 2.175,1; VREF -2.175,0.5
QFN-64 = smd 0.69 x 0.28: CFG_SEL[2] -4.31,-2.25; HS_IND/CFG_SEL[1] 4.31,0.75; LED_A_N[3]/PRTSWP[3] 4.31,3.25; LED_A_N[4]/PRTSWP[4] 4.31,-3.75; LED_A_N[7]/PRTSWP[7] -4.31,-3.25; LED_B_N[2]/BOOST[1] 4.31,3.75; LED_B_N[3]/GANG_EN 4.31,-3.25; LED_B_N[6] -4.31,-3.75; LED_B_N[7] -4.31,-2.75; OCS_N[5] 4.31,-2.75; OCS_N[6] 4.31,-1.25; OCS_N[7] 4.31,-1.75; PRTPWR[6] 4.31,-0.75; PRTPWR[7] 4.31,-2.25; RESET_N 4.31,1.25; SCL/SMBCLK/CFG_SEL[0] 4.31,0.25; SDA/SMBDATA/NON_REM[1] 4.31,-0.25; SUSP_IND/LOCAL_PWR/NON_REM[0] 4.31,2.25; USBDM_DN[1]/PRT_DIS_M[1] -4.31,3.75; USBDM_DN[2]/PRT_DIS_M[2] -4.31,2.75; USBDM_DN[3]/PRT_DIS_M[3] -4.31,1.25; USBDM_DN[4]/PRT_DIS_M[4] -4.31,0.25; USBDM_DN[5]/PRT_DIS_M[5] -4.31,-1.25; USBDP_DN[1]/PRT_DIS_P[1] -4.31,3.25; USBDP_DN[2]/PRT_DIS_P[2] -4.31,2.25; USBDP_DN[3]/PRT_DIS_P[3] -4.31,0.75; USBDP_DN[4]/PRT_DIS_P[4] -4.31,-0.25; USBDP_DN[5]/PRT_DIS_P[5] -4.31,-1.75; VBUS_DET 4.31,1.75; VDD33.1 -4.31,1.75; VDD33.2 -4.31,-0.75; VDD33.4 4.31,2.75 | smd 0.28 x 0.69: CRFILT 0.25,-4.31; LED_A_N[1]/PRTSWP[1] 2.75,4.31; LED_A_N[2]/PRTSWP[2] 3.75,4.31; LED_A_N[5]/PRTSWP[5] 3.25,-4.31; LED_A_N[6]/PRTSWP[6] -3.75,-4.31; LED_B_N[1]/BOOST[0] 3.25,4.31; LED_B_N[4] 3.75,-4.31; LED_B_N[5] -3.25,-4.31; OCS_N[1] 1.75,-4.31; OCS_N[2] 1.25,-4.31; OCS_N[3] -1.25,-4.31; OCS_N[4] -1.75,-4.31; PLLFILT -2.75,4.31; PRTPWR[1] 2.25,-4.31; PRTPWR[2] 0.75,-4.31; PRTPWR[3] -0.75,-4.31; PRTPWR[4] -2.25,-4.31; PRTPWR[5] 2.75,-4.31; RBIAS -3.25,4.31; TEST -2.75,-4.31; USBDM_DN[6]/PRT_DIS_M[6] 1.75,4.31; USBDM_DN[7]/PRT_DIS_M[7] 0.75,4.31; USBDM_UP -0.75,4.31; USBDP_DN[6]/PRT_DIS_P[6] 1.25,4.31; USBDP_DN[7]/PRT_DIS_P[7] 0.25,4.31; USBDP_UP -1.25,4.31; VDD33.3 -0.25,-4.31; VDD33.5 2.25,4.31; VDD33.6 -0.25,4.31; VDD33.7 -3.75,4.31; XTALIN/CLKIN -2.25,4.31; XTALOUT -1.75,4.31 | smd 4.7 x 4.7: GND 0,0
Q = drill 0.61 long: 1 -2.54,-7.62; 2 2.54,-7.62

### Placement (x,y rotation side)
C2000  21.08,71.63 270 top
C2001  20.83,52.58 270 top
C2002  20.83,32 270 top
C2003  18.54,21.08 0 top
C2004  37.59,21.34 0 top
C2005  57.4,21.59 0 top
C2006  80.52,21.84 0 top
C2007  72.39,73.91 90 top
C2008  18.8,71.63 270 top
C2009  18.54,52.58 270 top
C2010  18.54,32 270 top
C2011  18.54,18.8 0 top
C2012  37.59,19.05 0 top
C2013  57.4,19.3 0 top
C2014  80.52,19.56 0 top
C2015  74.68,73.91 90 top
C2016  21.08,81.79 270 top
C2017  20.83,62.99 270 top
C2018  20.83,42.42 270 top
C2019  8.13,21.08 0 top
C2020  27.18,21.34 0 top
C2021  46.99,21.59 0 top
C2022  70.1,22.1 0 top
C2023  72.39,62.23 90 top
C2024  11.94,83.31 180 top
C2025  11.94,64.52 180 top
C2026  11.68,43.94 180 top
C2027  6.6,11.94 270 top
C2028  25.65,12.19 270 top
C2029  45.47,12.45 270 top
C2030  68.58,12.95 270 top
C2031  81.53,60.96 0 top
C2032  12.95,90.17 0 top  (outside the outline)
C2033  5.33,90.17 0 top  (outside the outline)
C2034  45.09,76.2 0 top
C2035  55.24,76.2 0 top
C2036  53.59,52.07 270 top
C2037  44.45,64.52 90 top
C2038  42.16,64.52 90 top
C2039  60.96,28.96 180 top
C2040  60.96,31.24 180 top
C2041  51.05,57.15 0 top
C2042  51.05,59.69 0 top
C2043  58.42,51.82 90 top
C2044  56.13,51.82 90 top
C2045  2.54,68.58 270 bottom
C2046  2.54,48.26 270 bottom
C2047  2.54,28.19 270 bottom
C2048  17.02,2.54 180 bottom
C2049  37.34,2.54 180 bottom
C2050  57.91,2.54 180 bottom
C2051  78.74,2.54 180 bottom
C2052  77.98,83.06 180 bottom
D2000  89.92,57.4 180 top
J1  41.4,98.55 0 top  (outside the outline)
J2  37.59,98.55 0 top  (outside the outline)
J3  33.78,98.55 0 top  (outside the outline)
J5  29.97,98.55 0 top  (outside the outline)
J7  26.16,98.55 0 top  (outside the outline)
J9  33.21,75.37 0 top
J11  45.21,98.55 0 top  (outside the outline)
J13  26.16,91.44 0 top  (outside the outline)
J15  30.73,91.69 0 top  (outside the outline)
J16  79.5,98.55 0 top  (outside the outline)
J17  74.42,98.55 0 top  (outside the outline)
J18  69.34,98.55 0 top  (outside the outline)
J19  64.26,98.55 0 top  (outside the outline)
J20  59.18,98.55 0 top  (outside the outline)
J21  54.1,98.55 0 top  (outside the outline)
J22  49.02,98.55 0 top  (outside the outline)
J2000  4.32,68.58 0 top
J2001  4.32,48.26 0 top
J2002  4.32,28.19 0 top
J2003  17.02,4.32 90 top
J2004  37.34,4.32 90 top
J2005  57.91,4.32 90 top
J2006  78.74,4.32 90 top
J2007  77.98,81.28 270 top
JP3  -1.4,-16.26 0 top  (outside the outline)
JP4  -1.97,-21.46 0 top  (outside the outline)
JP5  -2.48,-26.67 0 top  (outside the outline)
JP6  -2.98,-31.88 0 top  (outside the outline)
JP7  -3.56,-37.08 0 top  (outside the outline)
JP8  -4.06,-42.29 0 top  (outside the outline)
JP9  -4.57,-47.5 0 top  (outside the outline)
JP10  -5.14,-52.7 0 top  (outside the outline)
JP11  -5.65,-57.91 0 top  (outside the outline)
JP12  -6.16,-63.12 0 top  (outside the outline)
JP13  -6.73,-68.33 0 top  (outside the outline)
JP14  -7.24,-73.53 0 top  (outside the outline)
JP15  -7.75,-78.74 0 top  (outside the outline)
JP16  -8.32,-83.95 0 top  (outside the outline)
LED2000  3.56,78.23 180 top
LED2001  3.56,57.91 180 top
LED2002  3.56,37.85 180 top
LED2003  7.37,3.56 270 top
LED2004  27.69,3.56 270 top
LED2005  48.26,3.56 270 top
LED2006  69.09,3.56 270 top
LED2007  87.63,82.04 90 top
LED2008  91.19,54.86 180 top
LED2009  91.19,51.05 180 top
LED2010  91.19,47.24 180 top
LED2011  91.19,43.43 180 top
LED2012  91.19,39.88 180 top
LED2013  91.19,36.32 180 top
LED2014  91.19,32.77 180 top
LED2015  91.19,53.34 0 top
LED2016  91.19,49.53 0 top
LED2017  91.19,45.72 0 top
LED2018  91.19,41.91 0 top
LED2019  91.19,38.35 0 top
LED2020  91.19,34.8 0 top
LED2021  91.19,31.24 0 top
Q2000  11.94,76.71 90 top
Q2001  11.68,57.91 90 top
Q2002  11.68,37.34 90 top
Q2003  13.21,11.94 180 top
Q2004  32.26,12.19 180 top
Q2005  52.07,12.45 180 top
Q2006  75.18,12.95 180 top
Q2007  81.53,67.82 270 top
R2000  11.94,81.03 0 top
R2001  11.94,62.23 0 top
R2002  11.68,41.66 0 top
R2003  8.89,11.94 90 top
R2004  27.94,12.19 90 top
R2005  47.75,12.45 90 top
R2006  70.87,12.95 90 top
R2007  81.53,63.25 180 top
R2008  16.51,81.79 90 top
R2009  16.26,62.99 90 top
R2010  16.26,42.42 90 top
R2011  8.13,16.51 180 top
R2012  27.18,16.76 180 top
R2013  46.99,17.02 180 top
R2014  70.1,17.53 180 top
R2015  76.96,62.23 270 top
R2016  13.21,71.37 90 top
R2017  12.95,52.58 90 top
R2018  12.95,32 90 top
R2019  18.54,13.21 180 top
R2020  37.59,13.46 180 top
R2021  57.4,13.72 180 top
R2022  80.52,14.48 180 top
R2023  80.26,73.91 270 top
R2024  16.51,71.63 90 top
R2025  16.26,52.58 90 top
R2026  16.26,32 90 top
R2027  18.54,16.51 180 top
R2028  37.59,16.76 180 top
R2029  57.4,17.02 180 top
R2030  80.52,17.27 180 top
R2031  76.96,73.91 270 top
R2032  10.92,71.37 90 top
R2033  10.67,52.58 90 top
R2034  10.67,32 90 top
R2035  18.54,10.92 180 top
R2036  37.59,11.18 180 top
R2037  57.4,11.43 180 top
R2038  80.52,12.19 180 top
R2039  82.55,73.91 270 top
R2040  20.07,77.47 270 top
R2041  19.81,58.67 270 top
R2042  19.81,38.1 270 top
R2043  12.7,20.07 0 top
R2044  31.5,20.32 0 top
R2045  51.31,20.57 0 top
R2046  74.42,21.08 0 top
R2047  73.41,67.31 90 top
R2048  18.8,81.79 90 top
R2049  18.54,62.99 90 top
R2050  18.54,42.42 90 top
R2051  8.13,18.8 180 top
R2052  27.18,19.05 180 top
R2053  46.99,19.3 180 top
R2054  70.1,19.81 180 top
R2055  74.68,62.23 270 top
R2056  6.35,75.95 270 top
R2057  6.35,55.63 270 top
R2058  6.35,35.56 270 top
R2059  9.65,6.35 0 top
R2060  29.97,6.35 0 top
R2061  50.55,6.35 0 top
R2062  71.37,6.35 0 top
R2063  85.34,79.25 180 top
R2064  50.16,76.2 0 top
R2065  51.31,52.07 90 top
R2066  51.05,73.66 0 top
R2067  60.96,33.53 180 top
R2068  51.05,71.37 0 top
R2069  51.05,69.09 0 top
R2070  51.05,66.8 0 top
R2071  51.05,64.52 0 top
R2072  51.05,62.23 0 top
R2073  60.71,51.82 270 top
R2074  87.38,53.85 180 top
R2075  87.38,50.29 180 top
R2076  87.38,46.48 180 top
R2077  87.38,42.8 180 top
R2078  87.38,39.12 180 top
R2079  87.38,35.56 180 top
R2080  87.38,32 180 top
R2081  62.29,92.65 90 top  (outside the outline)
R2082  66.29,92.58 90 top  (outside the outline)
R2083  70.29,92.52 90 top  (outside the outline)
R2084  74.3,92.46 90 top  (outside the outline)
R2085  78.3,92.39 90 top  (outside the outline)
R2086  82.3,92.33 90 top  (outside the outline)
R2087  86.3,92.27 90 top  (outside the outline)
R2088  90.3,92.2 90 top  (outside the outline)
R2089  94.3,92.14 90 top  (outside the outline)
R2090  98.3,92.08 90 top  (outside the outline)
R2091  102.3,92.01 90 top  (outside the outline)
R2092  106.3,91.95 90 top  (outside the outline)
R2093  110.3,91.88 90 top  (outside the outline)
R2094  114.3,91.82 90 top  (outside the outline)
U2000  17.27,76.96 90 top
U2001  17.02,58.17 90 top
U2002  17.02,37.59 90 top
U2003  12.95,17.27 180 top
U2004  32,17.53 180 top
U2005  51.82,17.78 180 top
U2006  74.93,18.29 180 top
U2007  76.2,67.56 270 top
U2008  40.39,41.66 0 top
X2000  50.16,87.63 0 top

### Tracks (layer width: path | path; a pad name or v marks a point on that pad's centre or on a via)
+3V3  (39 unrouted)
AUX_1.1  (1 unrouted)
  Top 0.406: J2000.BOARD+@1 J2000.BOARD+@2
AUX_1.2  (1 unrouted)
  Top 0.406: J2001.BOARD+@1 J2001.BOARD+@2
AUX_1.3  (1 unrouted)
  Top 0.406: J2002.BOARD+@1 J2002.BOARD+@2
AUX_1.4  (1 unrouted)
  Top 0.406: J2003.BOARD+@1 J2003.BOARD+@2
AUX_1.5  (1 unrouted)
  Top 0.406: J2004.BOARD+@1 J2004.BOARD+@2
AUX_1.6  (1 unrouted)
  Top 0.406: J2005.BOARD+@1 J2005.BOARD+@2
AUX_1.7  (1 unrouted)
  Top 0.406: J2006.BOARD+@1 J2006.BOARD+@2
AUX_2.1  (1 unrouted)
  Top 0.406: J2000.BOARD-@1 J2000.BOARD-@2
AUX_2.2  (1 unrouted)
  Top 0.406: J2001.BOARD-@1 J2001.BOARD-@2
AUX_2.3  (1 unrouted)
  Top 0.406: J2002.BOARD-@1 J2002.BOARD-@2
AUX_2.4  (1 unrouted)
  Top 0.406: J2003.BOARD-@1 J2003.BOARD-@2
AUX_2.5  (1 unrouted)
  Top 0.406: J2004.BOARD-@1 J2004.BOARD-@2
AUX_2.6  (1 unrouted)
  Top 0.406: J2005.BOARD-@1 J2005.BOARD-@2
AUX_2.7  (1 unrouted)
  Top 0.406: J2006.BOARD-@1 J2006.BOARD-@2
BOOST0  (1 unrouted)
BOOST1  (1 unrouted)
CAN_H  (7 unrouted)
  Top 0.406: J2000.CAN+@1 J2000.CAN+@2 | J2001.CAN+@1 J2001.CAN+@2 | J2002.CAN+@1 J2002.CAN+@2 | J2003.CAN+@1 J2003.CAN+@2 | J2004.CAN+@1 J2004.CAN+@2 | J2005.CAN+@1 J2005.CAN+@2 | J2006.CAN+@1 J2006.CAN+@2 | J2007.CAN+@2 J2007.CAN+@1
CAN_L  (7 unrouted)
  Top 0.406: J2000.CAN-@1 J2000.CAN-@2 | J2001.CAN-@1 J2001.CAN-@2 | J2002.CAN-@1 J2002.CAN-@2 | J2003.CAN-@1 J2003.CAN-@2 | J2004.CAN-@1 J2004.CAN-@2 | J2005.CAN-@1 J2005.CAN-@2 | J2006.CAN-@1 J2006.CAN-@2 | J2007.CAN-@2 J2007.CAN-@1
CFG_SEL0  (1 unrouted)
CFG_SEL1  (1 unrouted)
CFG_SEL2  (1 unrouted)
CRFILT  (1 unrouted)
FC_UART_RX
  Top 0.406: J2007.BOARD-@2 J2007.BOARD-@1
FC_UART_TX
  Top 0.406: J2007.BOARD+@2 J2007.BOARD+@1
GND  (101 unrouted)
  Top 0.254: C2008.2 19.05,71.12 19.05,70.78 | R2024.1 16.51,71.12 | C2015.2 74.93,74.93 74.93,74.76 | 73.6,80.01 73.66,80.01 73.66,74.76 | C2013.2 58.42,19.05 58.25,19.05 | J13.PAD 26.67,91.44
  Top 0.406: J2001.B-@1 J2001.B-@2 | J2000.B-@1 J2000.B-@2 | J2002.B-@1 J2002.B-@2 | J2005.B-@1 J2005.B-@2 | J2006.B-@1 J2006.B-@2 | J2007.B-@2 73.6,80.01 J2007.B-@1 | J2004.B-@1 J2004.B-@2 | J2003.B-@1 J2003.B-@2
  Top 1.422: C2007.2 73.66,74.76 C2015.2 74.93,74.76 R2031.1 | R2024.1 C2008.2 19.05,70.78 C2000.2 | R2025.1 C2001.2 | R2029.1 58.25,19.05 C2013.2 C2005.2
  Bottom 0.61: J2002.B-@1 2.54,23.82 C2047.2 | J2003.B-@1 21.39,2.54 C2048.2 | J2004.B-@1 41.71,2.54 C2049.2 | J2005.B-@1 62.29,2.54 C2050.2 | J2007.B-@1 73.6,83.06 C2052.1 | C2045.2 2.54,64.2 J2000.B-@1 | C2046.2 2.54,43.88 J2001.B-@1
LED1  (1 unrouted)
LED2  (1 unrouted)
LED3  (1 unrouted)
  Top 0.254: 86.22,46.68 R2076.2
LED4  (1 unrouted)
LED5  (1 unrouted)
LED6  (1 unrouted)
LED7  (1 unrouted)
LED_PWR  (7 unrouted)
MAIN_PWR  (20 unrouted)
  Top 0.216: 49.02,15.49 49.02,16.78 U2005.VCC
  Top 0.254: U2001.VCC 16.02,60.94 16,60.96 14.73,60.96 | 16.27,79.76 U2000.VCC | U2002.VCC 16.02,40.39 14.73,40.39 | U2003.VCC 10.16,16.27 10.16,14.99 | U2004.VCC 29.21,16.53 29.21,15.24 | U2006.VCC 72.14,17.29 72.14,16 | U2007.VCC 77.2,64.52 78.74,64.52 78.74,63.25 R2007.2
  Top 0.406: 14.99,79.76 16.27,79.76 | 70.87,16 72.14,16 | 47.75,15.49 49.02,15.49
  Top 0.61: 14.73,62.23 14.73,60.96 | 14.99,79.76 14.99,81.03 R2000.2 | 14.73,40.39 14.73,41.66 R2002.2 | 10.16,14.99 8.89,14.99 R2003.2 | 29.21,15.24 27.94,15.24 R2004.2 | R2006.2 70.87,16 | R2005.2 47.75,15.49
  Top 0.813: C2027.1 R2003.2 | C2028.1 R2004.2 | C2029.1 R2005.2 | R2006.2 C2030.1 | R2001.2 14.73,62.23
  Top 1.422: R2007.2 C2031.1
N$2
  Top 0.254: R2048.2 18.8,82.74
  Top 0.813: 18.8,82.74 C2016.1
N$3
  Top 0.406: R2049.2 18.29,63.94
  Top 0.813: 18.29,63.94 C2017.1
N$7  (via drill 0.6)
  Top 0.406: Q2000.G 13.84,74.17 v14.99,74.93 | v14.99,82.55 R2008.2
  Bottom 0.406: v14.99,74.93 v14.99,82.55
N$8
  Top 0.813: R2056.1 6.35,78.23 LED2000.A
N$10
  Top 0.813: R2057.1 6.35,57.91 LED2001.A
N$12  (1 unrouted)
  Top 0.813: R2051.2 7.18,18.9
N$17
  Top 0.813: R2050.2 C2018.1
N$19
  Top 0.813: R2058.1 6.35,37.85 LED2002.A
N$20
  Top 0.813: R2059.1 7.37,6.35 LED2003.A
N$23
  Top 0.813: R2053.2 46.04,19.4 C2021.1
N$27
  Top 0.813: R2052.2 26.23,19.15 C2020.1
N$28
  Top 0.813: R2060.1 27.69,6.35 LED2004.A
N$29  (via drill 0.6)
  Top 0.406: Q2001.G v14.73,56.13 | v14.73,63.75 R2009.2
  Bottom 0.406: v14.73,56.13 v14.73,63.75 14.73,64.01
N$36
  Top 0.813: R2054.2 69.15,19.81 C2022.1
N$37  (via drill 0.6)
  Top 0.406: Q2003.G v15.24,14.99 | R2011.2 v7.62,14.99
  Bottom 0.406: v7.62,14.99 v15.24,14.99
N$38  (via drill 0.6)
  Top 0.406: Q2004.G v34.29,15.24 | R2012.2 v26.42,15.24
  Bottom 0.406: v26.42,15.24 v34.29,15.24
N$39  (via drill 0.6)
  Top 0.406: Q2006.G 77.72,14.85 v77.22,16 | R2014.2 v69.09,16
  Bottom 0.406: v69.09,16 v77.22,16
N$48
  Top 0.813: R2063.1 87.63,79.25 LED2007.A
N$50  (via drill 0.6)
  Top 0.406: Q2002.G 13.58,34.8 v14.73,35.31 | v14.73,43.18 R2010.2
  Bottom 0.406: v14.73,35.31 v14.73,43.18
N$52
  Top 0.813: R2062.1 69.09,6.35 LED2006.A
N$58
  Top 0.813: R2055.2 74.68,61.28 C2023.1
N$59  (via drill 0.6)
  Top 0.406: Q2007.G v78.49,69.85 | R2015.2 v78.49,61.47
  Bottom 0.406: v78.49,61.47 v78.49,69.85
N$76  (1 unrouted)
  Top 0.254: LED2016.A 90.17,49.53 90.17,50.8 LED2009.K
N$81  (1 unrouted)
  Top 0.254: LED2015.A 90.17,53.34 90.17,54.61 LED2008.K
N$84  (1 unrouted)
  Top 0.254: LED2017.A 90.17,45.72 90.17,46.99 LED2010.K
N$85  (1 unrouted)
  Top 0.254: LED2018.A 90.17,41.91 90.17,43.18 LED2011.K
N$86  (1 unrouted)
  Top 0.254: LED2019.A 90.17,38.1 90.17,39.37 LED2012.K
N$87  (1 unrouted)
  Top 0.254: LED2020.A 90.17,34.29 90.17,36.83 LED2013.K
N$88  (1 unrouted)
  Top 0.254: LED2021.A 90.17,31.75 90.17,33.02 LED2014.K
N$104
  Top 0.813: R2061.1 48.26,6.35 LED2005.A
N$110  (via drill 0.6)
  Top 0.406: Q2005.G v54.1,15.49 | R2013.2 v46.23,15.49
  Bottom 0.406: v46.23,15.49 v54.1,15.49
NON_REM0  (1 unrouted)
NON_REM1  (1 unrouted)
PLLFILT  (1 unrouted)
RBIAS  (1 unrouted)
RESET_N  (1 unrouted)
SW0_EN
  Top 0.254: U2007.EN 77.2,71.12 78.74,71.12 78.74,71.63 82.55,71.63 R2039.2
SW0_GATE
  Top 0.254: 76.2,63.08 U2007.GATE
  Top 0.813: R2055.1 76.2,63.08 R2015.1
SW0_OUT  (via drill 0.41)
  Top 0.254: U2007.OUT 75.7,68.33 | 80.77,70.35 Q2007.S3 | 80.01,68.33 v80.01,68.58
  Top 0.406: J2007.B+@1 J2007.B+@2
  Top 0.813: 75.7,68.33 80.01,68.33 80.77,68.33 80.77,70.35 | Q2007.S1 Q2007.S2 Q2007.S3 | J2007.B+@2 84.68,79.28 R2063.2
  Bottom 0.254: v80.01,68.58 82.55,68.58 82.55,81.28 J2007.B+@1
  Bottom 0.61: J2007.B+@1 82.35,83.06 C2052.2
SW0_PG
  Top 0.254: 75.2,64.77 U2007.PG | 73.41,64.77 R2047.1
  Top 0.406: 73.41,64.77 75.2,64.77
SW0_PROG  (2 unrouted)
  Top 0.254: U2007.PROG 76.2,72.39 | 76.2,72.39 76.2,72.96 | 76.2,72.39 78.74,74.93 80.01,74.93 R2023.1
SW0_SENSE
  Top 0.254: U2007.SENSE 76.7,66.8 | 79.5,65.29 Q2007.D1
  Top 0.813: 76.7,66.8 79.5,66.8 79.5,65.29 | R2007.1 83.57,63.25 83.57,65.29 | 83.57,65.29 Q2007.D4 | 83.57,65.29 Q2007.D3 Q2007.D2 Q2007.D1
SW0_TIMER
  Top 0.254: U2007.TIMER 75.7,71.63 72.39,71.63 C2007.1
SW0_VREF
  Top 0.254: 80.26,72.96 R2023.2 78.23,72.96 78.23,71.63 76.7,71.63 U2007.VREF
SW1_EN
  Top 0.254: U2000.EN 16.27,73.91 14.73,73.91 14.73,73.15 10.92,73.15 R2032.2
SW1_GATE
  Top 0.254: U2000.GATE 17.27,80.94
  Top 0.813: R2008.1 17.27,80.94 R2048.1
SW1_OUT  (1 unrouted)
  Top 0.254: 17.77,76.2 U2000.OUT | Q2000.S3 12.45,74.18 | Q2000.S1 10.16,73.66
  Top 0.406: J2000.B+@1 J2000.B+@2
  Top 0.61: 17.77,76.2 12.45,76.2 12.45,74.18
  Top 0.813: Q2000.S3 Q2000.S2 Q2000.S1 10.03,73.97 | R2056.2 6.32,75.76 6.32,73.66 J2000.B+@2 6.38,72.9
  Bottom 0.61: J2000.B+@1 2.54,72.95 C2045.1
SW1_PG
  Top 0.254: 18.27,79.76 U2000.PG
  Top 0.406: 18.27,79.76 20.07,79.76 R2040.1
SW1_PROG
  Top 0.254: R2016.1 14.86,70.42 R2024.2 | 17.27,72.58 U2000.PROG
  Top 0.813: R2024.2 17.27,72.58 C2008.1
SW1_SENSE
  Top 0.254: 16.77,77.72 U2000.SENSE | Q2000.D1 13.97,79.24 | Q2000.D4 9.91,79.24
  Top 0.61: 16.77,77.72 13.97,77.72 13.97,79.24
  Top 0.813: Q2000.D1 Q2000.D2 Q2000.D3 Q2000.D4 | R2000.1 9.91,81.03 9.91,79.24
SW1_TIMER
  Top 0.254: U2000.TIMER 17.77,74.18 17.78,73.41 20.07,73.41 C2000.1
SW1_VREF
  Top 0.254: U2000.VREF 16.77,73.41 15.24,73.41 15.24,72.32 R2016.2
SW2_EN
  Top 0.254: U2001.EN 16.02,54.86 14.48,54.86 14.48,54.36 10.67,54.36 R2033.2
SW2_GATE
  Top 0.254: U2001.GATE 17.02,62.14
  Top 0.406: 17.02,62.14 R2009.1
  Top 0.813: 17.02,62.14 R2049.1
SW2_OUT  (1 unrouted)
  Top 0.254: 17.52,57.4 U2001.OUT | Q2001.S3 12.45,55.38 | 11.43,57.15 12.45,57.15 12.7,57.15
  Top 0.406: J2001.B+@1 J2001.B+@2
  Top 0.61: 17.52,57.4 12.45,57.4 12.45,57.15 12.45,55.38
  Top 0.813: Q2001.S1 Q2001.S2 Q2001.S3 | R2057.2 6.35,54.61 6.35,52.67 J2001.B+@2
  Bottom 0.61: J2001.B+@1 2.54,52.63 C2046.1
SW2_PG
  Top 0.254: U2001.PG 18.02,60.96
  Top 0.406: 18.02,60.96 19.81,60.96 R2041.1
SW2_PROG
  Top 0.254: 17.02,53.53 U2001.PROG | R2017.1 14.61,51.63 R2025.2
  Top 0.813: R2025.2 17.02,53.53 C2009.1
SW2_SENSE
  Top 0.254: 16.52,58.93 U2001.SENSE | Q2001.D1 13.72,60.44
  Top 0.406: Q2001.D4 9.91,60.44 Q2001.D3
  Top 0.61: 16.52,58.93 13.72,58.93 13.72,60.44
  Top 0.813: R2001.1 9.77,62.23 Q2001.D4 | 9.91,60.44 Q2001.D2 Q2001.D1
SW2_TIMER
  Top 0.254: U2001.TIMER 17.52,55.38 17.53,54.36 19.49,54.36 C2001.1
SW2_VREF
  Top 0.254: 12.96,53.54 R2017.2 14.99,53.53 14.99,54.36 16.52,54.36 U2001.VREF
SW3_EN
  Top 0.254: U2002.EN 16.02,34.29 14.48,34.29 14.48,33.78 10.67,33.78 R2034.2
SW3_GATE
  Top 0.254: U2002.GATE 17.02,41.57
  Top 0.813: R2050.1 17.02,41.57 R2010.1
SW3_OUT  (1 unrouted)
  Top 0.254: 17.52,36.83 U2002.OUT | Q2002.S3 12.45,34.81 | J2002.B+@2 6.35,33.02 | 6.35,34.29 R2058.2
  Top 0.406: J2002.B+@1 J2002.B+@2
  Top 0.813: Q2002.S1 Q2002.S2 Q2002.S3 | 17.52,36.83 12.7,36.83 12.45,36.83 12.45,34.81 | 6.35,33.02 6.35,34.29
  Bottom 0.61: J2002.B+@1 2.54,32.57 C2047.1
SW3_PG
  Top 0.254: U2002.PG 18.02,40.39
  Top 0.406: 18.02,40.39 19.81,40.39 R2042.1
SW3_PROG
  Top 0.254: 17.02,32.95 U2002.PROG | R2018.1 14.36,31.05 R2026.2
  Top 0.813: R2026.2 17.02,32.95 C2010.1
SW3_SENSE
  Top 0.254: 16.52,38.35 U2002.SENSE | Q2002.D1 13.72,39.87
  Top 0.813: Q2002.D4 Q2002.D3 Q2002.D2 Q2002.D1 | 16.52,38.35 13.72,38.35 13.72,39.87
  Top 1.016: R2002.1 9.77,41.66 Q2002.D4
SW3_TIMER
  Top 0.254: U2002.TIMER 17.52,33.78 20.83,33.78 C2002.1
SW3_VREF
  Top 0.254: 12.96,32.96 R2018.2 14.99,32.95 14.99,33.78 16.52,33.78 U2002.VREF
SW4_EN
  Top 0.254: U2003.EN 16.26,16.27 16.26,14.73 16.76,14.73 16.76,10.92 R2035.2
SW4_GATE
  Top 0.254: 8.98,17.27 U2003.GATE
  Top 0.813: R2011.1 8.98,17.27 R2051.1
SW4_OUT  (1 unrouted)
  Top 0.254: 13.72,17.77 U2003.OUT | Q2003.S3 15.74,12.7
  Top 0.406: J2003.B+@1 J2003.B+@2
  Top 0.813: Q2003.S1 Q2003.S2 Q2003.S3 | 13.72,17.77 13.72,12.7 15.74,12.7 | J2003.B+@2 10.32,6.32 R2059.2
  Bottom 0.61: J2003.B+@1 12.64,2.54 C2048.1
SW4_PG
  Top 0.254: U2003.PG 10.16,18.27
  Top 0.406: 10.16,18.27 10.16,20.07 R2043.1
SW4_PROG
  Top 0.254: U2003.PROG 17.59,17.27 | R2019.1 19.49,14.61 R2027.2
  Top 0.813: R2027.2 17.59,17.27 C2011.1
SW4_SENSE
  Top 0.254: 12.19,16.77 U2003.SENSE | Q2003.D1 10.68,13.97
  Top 0.813: R2003.1 8.89,10.16 9.02,10.03 Q2003.D4 Q2003.D3 Q2003.D2 Q2003.D1 | 12.19,16.77 12.19,13.97 10.68,13.97
SW4_TIMER
  Top 0.254: U2003.TIMER 16.76,17.77 16.76,21.08 C2003.1
SW4_VREF
  Top 0.254: U2003.VREF 15.24,16.77 15.24,16.76 16.76,16.76 16.76,15.24 17.59,15.24 R2019.2
SW5_EN
  Top 0.254: U2004.EN 35.31,16.53 35.31,14.99 35.81,14.99 35.81,11.18 R2036.2
SW5_GATE
  Top 0.254: U2004.GATE 28.03,17.53 R2012.1
  Top 0.813: R2012.1 R2052.1
SW5_OUT  (1 unrouted)
  Top 0.254: 32.77,18.03 U2004.OUT | Q2004.S3 34.78,12.95
  Top 0.406: J2004.B+@1 J2004.B+@2
  Top 0.813: 32.77,18.03 32.77,12.95 34.78,12.95 | Q2004.S3 Q2004.S2 Q2004.S1 | J2004.B+@2 31.95,6.35 R2060.2
  Bottom 0.61: J2004.B+@1 32.96,2.54 C2049.1
SW5_PG
  Top 0.254: U2004.PG 29.21,18.53 | 29.21,20.32 R2044.1
  Top 0.406: 29.21,18.53 29.21,20.32
SW5_PROG
  Top 0.254: U2004.PROG 36.64,17.53 | R2020.1 38.54,14.86 R2028.2
  Top 0.813: R2028.2 36.64,17.53 C2012.1
SW5_SENSE
  Top 0.254: 31.24,17.03 U2004.SENSE | Q2004.D1 29.73,14.22
  Top 0.813: 31.24,17.03 31.24,14.22 29.73,14.22 | R2004.1 27.94,10.16 29.73,10.16 Q2004.D4 Q2004.D3 Q2004.D2 Q2004.D1
SW5_TIMER
  Top 0.254: U2004.TIMER 35.81,18.03 35.81,21.34 C2004.1
SW5_VREF
  Top 0.254: U2004.VREF 35.81,17.03 35.81,15.49 36.64,15.49 R2020.2
SW6_EN
  Top 0.254: U2005.EN 55.12,16.78 55.12,15.24 55.63,15.24 55.63,11.43 R2037.2
SW6_GATE
  Top 0.254: U2005.GATE 47.75,17.78 47.75,17.11 R2013.1
  Top 0.813: R2013.1 R2053.1
SW6_OUT  (1 unrouted)
  Top 0.254: 52.58,18.28 U2005.OUT | Q2005.S3 54.6,13.21
  Top 0.406: J2005.B+@2 J2005.B+@1
  Top 0.813: 52.58,18.28 52.58,13.21 54.6,13.21 | Q2005.S1 Q2005.S2 Q2005.S3 | R2061.2 51.4,6.32 J2005.B+@2
  Bottom 0.254: J2005.B+@2 53.34,6.35 | 53.54,3.81 53.34,3.81
  Bottom 0.61: J2005.B+@1 53.54,3.81 53.54,2.54 C2050.1
SW6_PG
  Top 0.254: U2005.PG 49.02,18.78 | 49.02,20.57 R2045.1
  Top 0.406: 49.02,18.78 49.02,20.57
SW6_PROG
  Top 0.254: 56.45,17.78 U2005.PROG
  Top 0.406: R2021.1 58.25,15.32 R2029.2
  Top 0.813: R2029.2 56.45,17.78 C2013.1
SW6_SENSE
  Top 0.254: 51.05,17.28 U2005.SENSE | Q2005.D1 49.54,14.22
  Top 0.813: 51.05,17.28 51.05,14.22 49.54,14.22 | R2005.1 47.75,10.41 49.54,10.41 Q2005.D4 Q2005.D3 Q2005.D2 Q2005.D1
SW6_TIMER
  Top 0.254: U2005.TIMER 55.63,18.28 55.63,21.59 C2005.1
SW6_VREF
  Top 0.254: 56.45,13.72 R2021.2 56.45,15.75 55.63,15.75 55.63,17.28 U2005.VREF
SW7_EN
  Top 0.254: U2006.EN 78.23,17.29 78.23,15.75 78.74,15.24 78.74,12.19 R2038.2
SW7_GATE
  Top 0.254: 70.95,18.29 U2006.GATE
  Top 0.813: R2054.1 70.95,18.29 R2014.1
SW7_OUT  (1 unrouted)
  Top 0.254: 75.69,18.79 U2006.OUT | Q2006.S3 77.71,13.72 | 73.66,6.33 73.66,6.35 | 77.71,11.43 77.47,11.43
  Top 0.406: J2006.B+@2 J2006.B+@1
  Top 0.813: 75.69,18.79 75.69,13.72 77.71,13.72 | Q2006.S3 Q2006.S2 77.71,11.43 Q2006.S1 | J2006.B+@2 74.32,6.32 73.66,6.33 R2062.2
  Bottom 0.61: J2006.B+@1 74.36,2.54 C2051.1
SW7_PG
  Top 0.254: U2006.PG 72.14,19.29 | 72.14,21.08 R2046.1
  Top 0.406: 72.14,19.29 72.14,21.08
SW7_PROG
  Top 0.254: U2006.PROG 79.57,18.29 | R2022.1 81.47,15.12 R2030.2
  Top 0.813: R2030.2 79.57,18.29 C2014.1
SW7_SENSE
  Top 0.254: 74.17,17.79 U2006.SENSE | Q2006.D1 72.66,14.73
  Top 0.813: 74.17,17.79 74.17,14.73 72.66,14.73 | R2006.1 70.87,11.18 72.66,11.18 | 72.66,11.18 Q2006.D4 | 72.66,11.18 Q2006.D3 Q2006.D2 Q2006.D1
SW7_TIMER
  Top 0.254: U2006.TIMER 78.74,18.79 78.74,21.84 C2006.1
SW7_VREF
  Top 0.254: 79.56,14.49 R2022.2 79.57,16 78.74,16 78.74,17.79 U2006.VREF
USB0_H  (1 unrouted)
  Top 0.406: J2007.USB+@2 J2007.USB+@1
USB0_L  (1 unrouted)
  Top 0.406: J2007.USB-@2 J2007.USB-@1
USB1_H  (2 unrouted)
  Top 0.406: J2000.USB+@1 J2000.USB+@2
USB1_L  (2 unrouted)
  Top 0.406: J2000.USB-@1 J2000.USB-@2
USB2_H  (2 unrouted)
  Top 0.406: J2001.USB+@1 J2001.USB+@2
USB2_L  (2 unrouted)
  Top 0.406: J2001.USB-@1 J2001.USB-@2
USB3_H  (2 unrouted)
  Top 0.406: J2002.USB+@1 J2002.USB+@2
USB3_L  (2 unrouted)
  Top 0.406: J2002.USB-@1 J2002.USB-@2
USB4_H  (2 unrouted)
  Top 0.406: J2003.USB+@1 J2003.USB+@2
USB4_L  (2 unrouted)
  Top 0.254: J2003.USB-@2 16.26,6.43
  Top 0.406: J2003.USB-@1 J2003.USB-@2
USB5_H  (2 unrouted)
  Top 0.406: J2004.USB+@1 J2004.USB+@2
USB5_L  (2 unrouted)
  Top 0.406: J2004.USB-@1 J2004.USB-@2
USB6_H  (2 unrouted)
  Top 0.406: J2005.USB+@1 J2005.USB+@2
USB6_L  (2 unrouted)
  Top 0.406: J2005.USB-@1 J2005.USB-@2
USB7_H  (2 unrouted)
  Top 0.406: J2006.USB+@1 J2006.USB+@2
USB7_L  (2 unrouted)
  Top 0.406: J2006.USB-@1 J2006.USB-@2
XTALIN  (3 unrouted)
XTALOUT  (3 unrouted)
  Top 0.254: R2064.2 50.8,76.2 | C2035.1 54.61,76.2